# EAGLE design PCB1a_T-ETH-Lite-ESP32S3 (EAGLE 9.6.2)

## Sheet 1 of 3
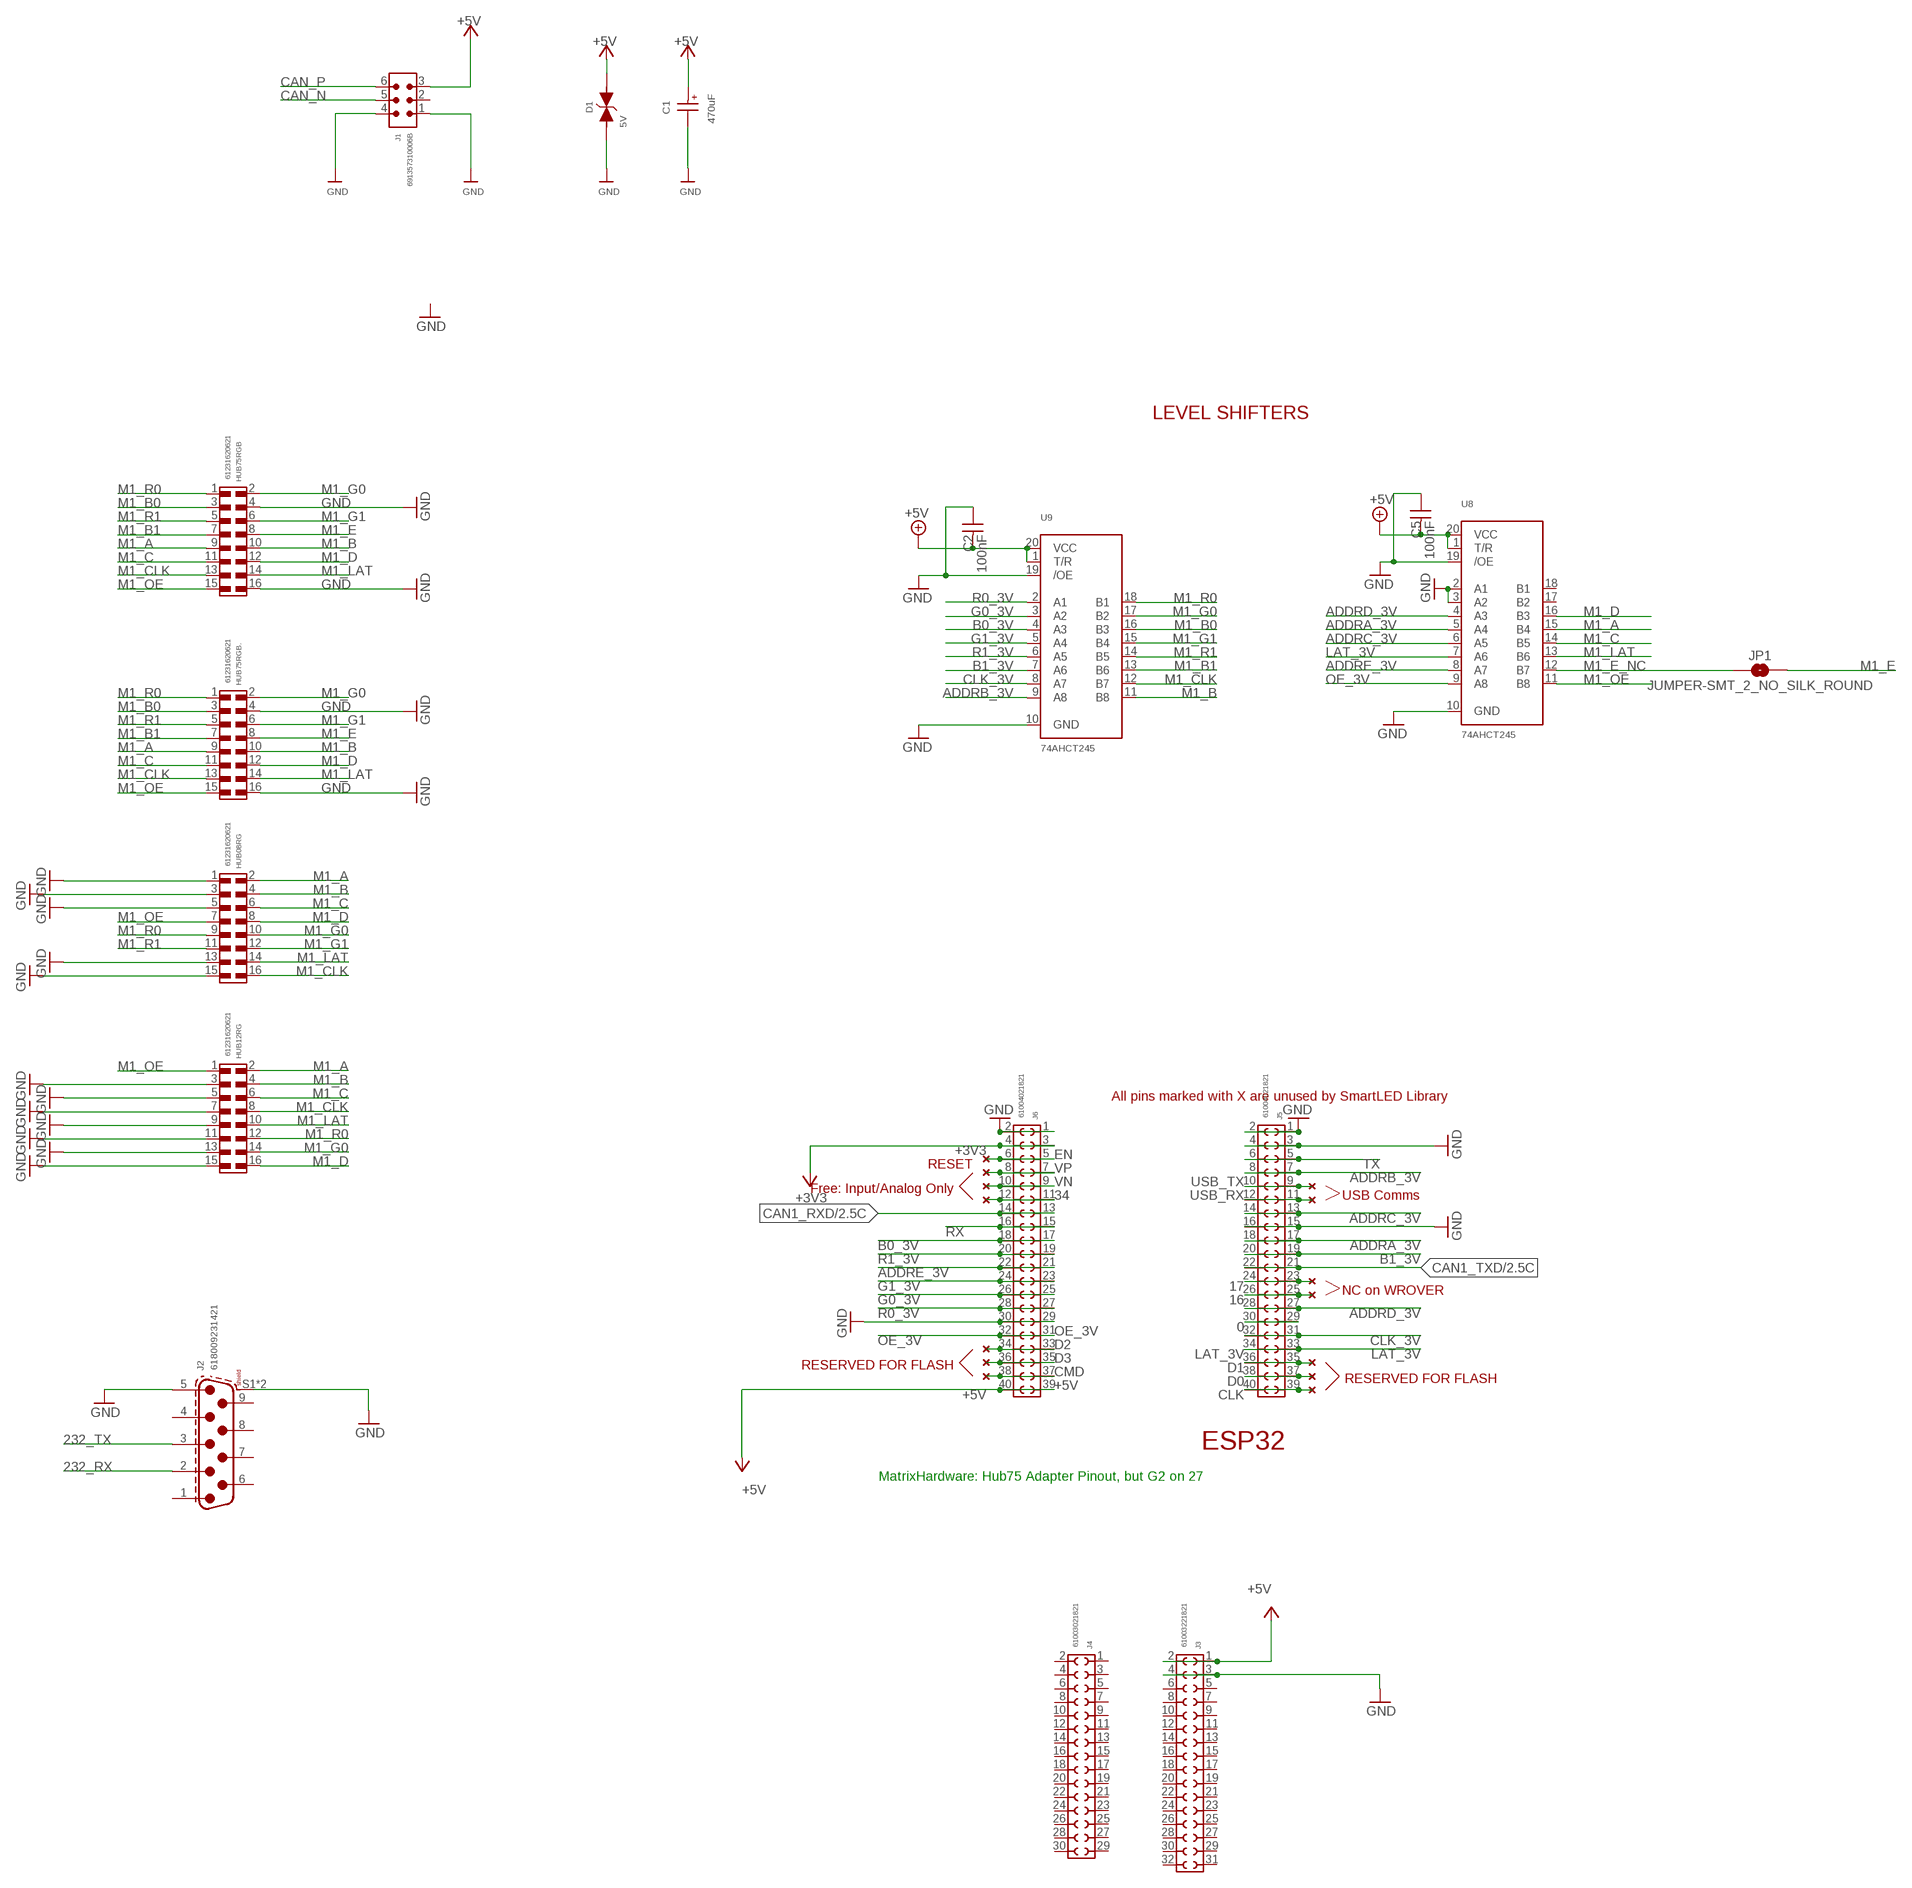
[diagram p0: schematic, sheet 1]

### Parts
C1  470uF  WCAP-AS5H_10X10.5_865230357008  [WCAP-AS5H_10X10.5(DXL)]
C2  100nF  WCAP-CSGP_0805_H0.8_885012207098_50V(DC)_R  [WCAP-CSGP_0805_H0.8_R]
C5  100nF  WCAP-CSGP_0805_H0.8_885012207098_50V(DC)_R  [WCAP-CSGP_0805_H0.8_R]
D1  5V  WE-TVSP_DO-214AB_3000W_BI_824551500  [WE-TVSP_DO-214AB_BIDIRECTIONAL]
HUB08RG  61231620621  6123XX20621_61231620621  [61231620621]
HUB12RG  61231620621  6123XX20621_61231620621  [61231620621]
HUB75RGB  61231620621  6123XX20621_61231620621  [61231620621]
HUB75RGB.  61231620621  6123XX20621_61231620621  [61231620621]
J1  691357310006B  [691357310006B]
J2  618009231421  6180XX231421_618009231421  [618009231421]
J3  61003221821  6100XX21821_61003221821  [61003221821]
J4  61003021821  6100XX21821_61003021821  [61003021821]
J5  61004021821  6100XX21821_61004021821  [61004021821]
J6  61004021821  6100XX21821_61004021821  [61004021821]
JP1  JUMPER-SMT_2_NO_SILK_ROUND  [SMT-JUMPER_2_NO_SILK_ROUND]
U8  74AHCT245  74LCX245_TSSOP20  [TSSOP20]
U9  74AHCT245  74LCX245_TSSOP20  [TSSOP20]
U$2  NC  (no package)
U$3  NC  (no package)
U$4  NC  (no package)
U$5  NC  (no package)
U$6  NC  (no package)
U$7  NC  (no package)
U$8  NC  (no package)
U$9  NC  (no package)
U$10  NC  (no package)
U$11  NC  (no package)
U$13  NC  (no package)
U$15  NC  (no package)
U$16  NC  (no package)
U$17  NC  (no package)

### Nets
0: J5.29 J5.30
16: J5.25 J5.26 U$17.P$1
17: J5.23 J5.24 U$16.P$1
34: J6.11 J6.12 U$10.P$1
232_RX: J2.2 ; also sheet 3
232_TX: J2.3 ; also sheet 3
+3V3: J6.3 J6.4 ; also sheet 2,3
+5V [usbvcc]: C1.1(+) C2.2 C5.2 D1.2 J1.3 J3.1 J3.2 J6.39 J6.40 U8.1(T/R) U8.20(VCC) U9.1(T/R) U9.20(VCC) ; also sheet 2
ADDRA_3V: J5.17 J5.18 U8.5(A4)
ADDRB_3V: J5.7 J5.8 U9.9(A8)
ADDRC_3V: J5.13 J5.14 U8.6(A5)
ADDRD_3V: J5.27 J5.28 U8.4(A3)
ADDRE_3V: J6.21 J6.22 U8.8(A7)
B0_3V: J6.17 J6.18 U9.4(A3)
B1_3V: J5.19 J5.20 U9.7(A6)
CAN1_RXD: J6.13 J6.14 ; also sheet 2
CAN1_TXD: J5.21 J5.22 ; also sheet 2
CAN_N: J1.5 ; also sheet 2
CAN_P: J1.6 ; also sheet 2
CLK: J5.39 J5.40 U$5.P$1
CLK_3V: J5.31 J5.32 U9.8(A7)
CMD: J6.37 J6.38 U$2.P$1
D0: J5.37 J5.38 U$6.P$1
D1: J5.35 J5.36 U$7.P$1
D2: J6.33 J6.34 U$4.P$1
D3: J6.35 J6.36 U$3.P$1
EN: J6.5 J6.6 U$11.P$1
G0_3V: J6.25 J6.26 U9.3(A2)
G1_3V: J6.23 J6.24 U9.5(A4)
GND: C1.2(-) C2.1 C5.1 D1.1 HUB08RG.1 HUB08RG.3 HUB08RG.5 HUB08RG.13 HUB08RG.15 HUB12RG.3 HUB12RG.5 HUB12RG.7 HUB12RG.9 HUB12RG.11 HUB12RG.13 HUB12RG.15 HUB75RGB.4 HUB75RGB.16 HUB75RGB..4 HUB75RGB..16 J1.1 J1.4 J2.5 J2.S1(SHIELD) J2.S2(SHIELD) J3.3 J3.4 J5.1 J5.2 J5.3 J5.4 J5.15 J5.16 J6.1 J6.2 J6.29 J6.30 U8.2(A1) U8.3(A2) U8.10(GND) U8.19(/OE) U9.10(GND) U9.19(/OE) ; also sheet 2,3
LAT_3V: J5.33 J5.34 U8.7(A6)
M1_A: HUB08RG.2 HUB12RG.2 HUB75RGB.9 HUB75RGB..9 U8.15(B4)
M1_B: HUB08RG.4 HUB12RG.4 HUB75RGB.10 HUB75RGB..10 U9.11(B8)
M1_B0: HUB75RGB.3 HUB75RGB..3 U9.16(B3)
M1_B1: HUB75RGB.7 HUB75RGB..7 U9.13(B6)
M1_C: HUB08RG.6 HUB12RG.6 HUB75RGB.11 HUB75RGB..11 U8.14(B5)
M1_CLK: HUB08RG.16 HUB12RG.8 HUB75RGB.13 HUB75RGB..13 U9.12(B7)
M1_D: HUB08RG.8 HUB12RG.16 HUB75RGB.12 HUB75RGB..12 U8.16(B3)
M1_E: HUB75RGB.8 HUB75RGB..8 JP1.2
M1_E_NC: JP1.1 U8.12(B7)
M1_G0: HUB08RG.10 HUB12RG.14 HUB75RGB.2 HUB75RGB..2 U9.17(B2)
M1_G1: HUB08RG.12 HUB75RGB.6 HUB75RGB..6 U9.15(B4)
M1_LAT: HUB08RG.14 HUB12RG.10 HUB75RGB.14 HUB75RGB..14 U8.13(B6)
M1_OE: HUB08RG.7 HUB12RG.1 HUB75RGB.15 HUB75RGB..15 U8.11(B8)
M1_R0: HUB08RG.9 HUB12RG.12 HUB75RGB.1 HUB75RGB..1 U9.18(B1)
M1_R1: HUB08RG.11 HUB75RGB.5 HUB75RGB..5 U9.14(B5)
OE_3V: J6.31 J6.32 U8.9(A8)
R0_3V: J6.27 J6.28 U9.2(A1)
R1_3V: J6.19 J6.20 U9.6(A5)
RX: J6.15 J6.16 ; also sheet 3
TX: J5.5 J5.6 ; also sheet 3
USB_RX: J5.11 J5.12 U$15.P$1
USB_TX: J5.9 J5.10 U$13.P$1
VN: J6.9 J6.10 U$8.P$1
VP: J6.7 J6.8 U$9.P$1
Unconnected: J1.2 J2.1 J2.4 J2.6 J2.7 J2.8 J2.9 J3.5 J3.6 J3.7 J3.8 J3.9 J3.10 J3.11 J3.12 J3.13 J3.14 J3.15 J3.16 J3.17 J3.18 J3.19 J3.20 J3.21 J3.22 J3.23 J3.24 J3.25 J3.26 J3.27 J3.28 J3.29 J3.30 J3.31 J3.32 J4.1 J4.2 J4.3 J4.4 J4.5 J4.6 J4.7 J4.8 J4.9 J4.10 J4.11 J4.12 J4.13 J4.14 J4.15 J4.16 J4.17 J4.18 J4.19 J4.20 J4.21 J4.22 J4.23 J4.24 J4.25 J4.26 J4.27 J4.28 J4.29 J4.30 U8.17(B2) U8.18(B1)

### Notes on the sheet
- LEVEL SHIFTERS
- All pins marked with X are unused by SmartLED Library
- RESET
- Free: Input/Analog Only
- USB Comms
- NC on WROVER
- RESERVED FOR FLASH
- RESERVED FOR FLASH
- ESP32
- MatrixHardware: Hub75 Adapter Pinout, but G2 on 27

## Sheet 2 of 3
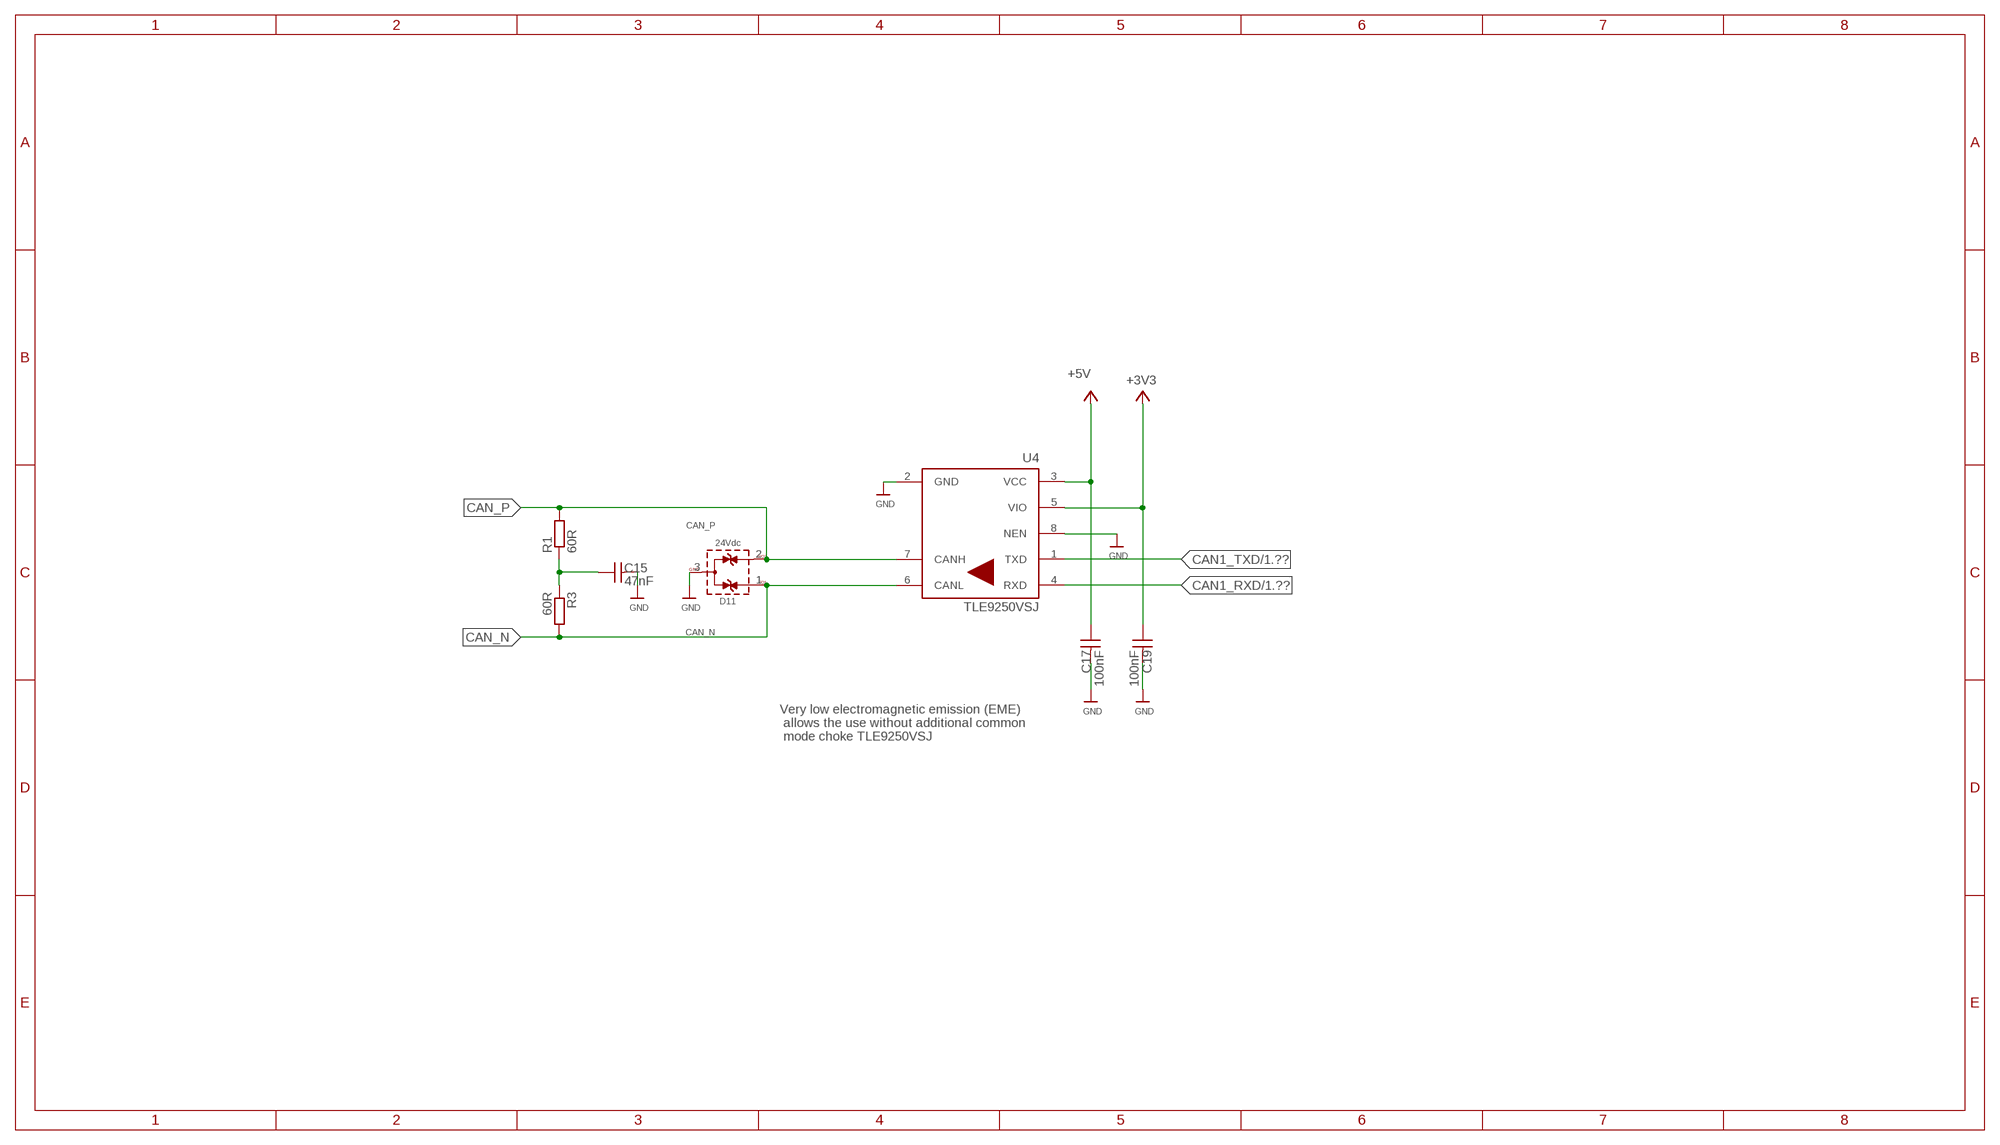
[diagram p1: schematic, sheet 2]

### Parts
C15  47nF  WCAP-CSGP_0805_H0.8_885012207096_50V(DC)_R  [WCAP-CSGP_0805_H0.8_R]
C17  100nF  WCAP-CSGP_0805_H0.8_885012207098_50V(DC)_R  [WCAP-CSGP_0805_H0.8_R]
C19  100nF  WCAP-CSGP_0805_H0.8_885012207098_50V(DC)_R  [WCAP-CSGP_0805_H0.8_R]
D11  24Vdc  WE-TVS_SOT23-3L_824094024  [WE-TVS_SOT23-3L]
R1  60R  R-EU_R0805  [R0805]
R3  60R  R-EU_R0805  [R0805]
U4  TLE9250VSJ  [SOIC127P602X173-8N-V]

### Nets
+3V3: C19.1 U4.5(VIO) ; also sheet 1,3
+5V [usbvcc]: C17.1 U4.3(VCC) ; also sheet 1
CAN1_RXD: U4.4(RXD) ; also sheet 1
CAN1_TXD: U4.1(TXD) ; also sheet 1
CAN_N: D11.1(I/O1) R3.2 U4.6(CANL) ; also sheet 1
CAN_P: D11.2(I/O2) R1.2 U4.7(CANH) ; also sheet 1
GND: C15.2 C17.2 C19.2 D11.3(GND) U4.2(GND) U4.8(NEN) ; also sheet 1,3
N$20: C15.1 R1.1 R3.1

### Notes on the sheet
- Very low electromagnetic emission (EME)
   allows the use without additional common
   mode choke TLE9250VSJ

## Sheet 3 of 3
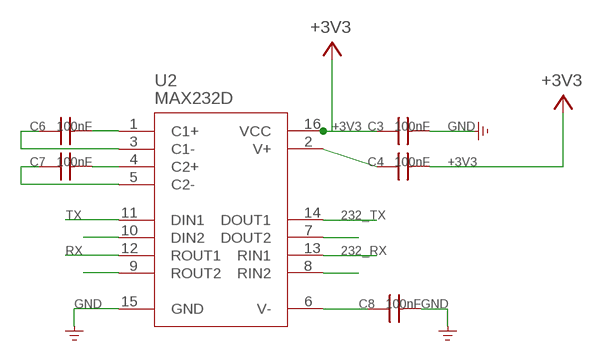
[diagram p2: schematic, sheet 3]

### Parts
C3  100nF  WCAP-CSGP_0805_H0.8_885012207098_50V(DC)_R  [WCAP-CSGP_0805_H0.8_R]
C4  100nF  WCAP-CSGP_0805_H0.8_885012207098_50V(DC)_R  [WCAP-CSGP_0805_H0.8_R]
C6  100nF  WCAP-CSGP_0805_H0.8_885012207098_50V(DC)_R  [WCAP-CSGP_0805_H0.8_R]
C7  100nF  WCAP-CSGP_0805_H0.8_885012207098_50V(DC)_R  [WCAP-CSGP_0805_H0.8_R]
C8  100nF  WCAP-CSGP_0805_H0.8_885012207098_50V(DC)_R  [WCAP-CSGP_0805_H0.8_R]
U2  MAX232D  MAX3232-SOIC16  [SOIC16]

### Nets
232_RX: U2.13(RIN1) ; also sheet 1
232_TX: U2.14(DOUT1) ; also sheet 1
+3V3: C3.1 C4.2 U2.16(VCC) ; also sheet 1,2
GND: C3.2 C8.2 U2.15(GND) ; also sheet 1,2
N$33: C6.2 U2.1(C1+)
N$34: C6.1 U2.3(C1-)
N$35: C7.2 U2.4(C2+)
N$36: C7.1 U2.5(C2-)
N$37: C4.1 U2.2(V+)
N$38: C8.1 U2.6(V-)
N$39: U2.9(ROUT2)
N$40: U2.10(DIN2)
N$46: U2.7(DOUT2)
N$47: U2.8(RIN2)
RX: U2.12(ROUT1) ; also sheet 1
TX: U2.11(DIN1) ; also sheet 1

## Library data of the parts
C1 = Wurth_Capacitors_WCAP-AS5H:WCAP-AS5H_10X10.5: WCAP-AS5H Aluminium Electrolytic Capacitors Long Life +105 °C Characteristics Long life product series Mounting style: V-Chip SMT Capacitance range: 0.1 µF ‒ 1000 µF Capacitance tolerance: ±20 % Voltage range (UR): 6.3 ‒ 50 V(DC) Operating temperature: -40 °C up to +105 °C Endurance: 5000 h @ +105 °C Dimensions (DxL) in mm: 4.0 x 5.5 up to 10.0 x 10.5 Recommended soldering: Reflow soldering Applications Long life applications (industry, medical) Input and output capacitor for switched-mode power supply Filtering Smoothing e.g. DC/DC converter, AC/DC converter, satellite receiver, control panel <https://www.we-online.com/catalog/media/o55801v209%20Family_WCAP-AS5H.jpg> Details see: www.we-online.com/catalog/WCAP-AS5H <www.we-online.com/catalog/WCAP-AS5H/?utm_source=eagle_model&utm_medium=description_link&utm_campaign=eisos_eagle> Updated by Ella Wu 2022-07-27 2022(C) Würth Elektronik; DATASHEET-URL: https://www.we-online.com/redexpert/spec/865230357008?ae; DF: 22%; DIAMETER: 10mm; ENDURANCE: 5000h; HEIGHT: 10.5mm; I-LEAK: 75.2uA; I-RIPPLE: 320mA; OPERATING-TEMPERATURE: -40 °C up to +105 °C; PART-NUMBER: 865230357008; TECHNICAL-REFERENCE: ASDF105471M016DVCTEE000; VR: 16V(DC)
C2-C8 C17 C19 = Wurth_Capacitors_WCAP-CSGP:WCAP-CSGP_0805_H0.8: WCAP-CSGP MLCCs 0805 Characteristics General purpose product series High performance ceramic High electrical precision and stability ceramic especially for NP0 Minimal aging especially for NP0 Mounting style: SMT-Chip Ceramic: NP0 (Class I), X5R (Class II), X7R (Class II) Temperature coefficient: ±30 ppm/°C; ±0.54 % for NP0 ±15 % for X5R and X7R Operating temperature: -55 °C up to + 125 °C for NP0 and X7R -55 °C up to + 85 °C for X5R Termination: Cu/Ni/Sn Recommended soldering: Reflow soldering Wave soldering for size 0603 Wave soldering for size 0805 (only valid for the thickness ≤0.85 mm) Applications Temperature compensation (NP0) Coupling Decoupling Bypass Smoothing Filtering Resonant circuit <https://www.we-online.com/catalog/media/o177837v209%20MLCC_GRP_all.jpg> Details see: https://www.we-online.com/catalog/en/pbs/capacitors/multilayer_ceramic_chip_capacitors/mlcc_general_purpose Updated by Ella Wu 2022-02-15 2022(C) Würth Elektronik; CERAMIC-TYPE: X7R Class II; DATASHEET-URL: https://www.we-online.com/redexpert/spec/885012207098?ae; DF: 2.5%; HEIGHT: 0.8mm; MOUNT: SMT; OPERATING-TEMPERATURE: -55 up to +125 °C; PART-NUMBER: 885012207098; QMIN: -; RISO: 5GOhm; SIZE: 0805; TECHNICAL-REFERENCE: X7R0805104K050DFCT10000; VR: 50V(DC)
C15 = Wurth_Capacitors_WCAP-CSGP:WCAP-CSGP_0805_H0.8: WCAP-CSGP MLCCs 0805 Characteristics General purpose product series High performance ceramic High electrical precision and stability ceramic especially for NP0 Minimal aging especially for NP0 Mounting style: SMT-Chip Ceramic: NP0 (Class I), X5R (Class II), X7R (Class II) Temperature coefficient: ±30 ppm/°C; ±0.54 % for NP0 ±15 % for X5R and X7R Operating temperature: -55 °C up to + 125 °C for NP0 and X7R -55 °C up to + 85 °C for X5R Termination: Cu/Ni/Sn Recommended soldering: Reflow soldering Wave soldering for size 0603 Wave soldering for size 0805 (only valid for the thickness ≤0.85 mm) Applications Temperature compensation (NP0) Coupling Decoupling Bypass Smoothing Filtering Resonant circuit <https://www.we-online.com/catalog/media/o177837v209%20MLCC_GRP_all.jpg> Details see: https://www.we-online.com/catalog/en/pbs/capacitors/multilayer_ceramic_chip_capacitors/mlcc_general_purpose Updated by Ella Wu 2022-02-15 2022(C) Würth Elektronik; CERAMIC-TYPE: X7R Class II; DATASHEET-URL: https://www.we-online.com/redexpert/spec/885012207096?ae; DF: 2.5%; HEIGHT: 0.8mm; MOUNT: SMT; OPERATING-TEMPERATURE: -55 up to +125 °C; PART-NUMBER: 885012207096; QMIN: -; RISO: 10GOhm; SIZE: 0805; TECHNICAL-REFERENCE: X7R0805473K050DFCT10000; VR: 50V(DC)
D1 = Wurth_EMC Components_WE-TVSP:WE-TVSP_DO-214AB_3000W_BI: WE-TVSP Power TVS Diode Characteristics Low Profile Package Glass passivated Juction Excellent clamping capability Fast response time MSL Level 1, per J-STD-020 Classification of the plastic case: UL 94 V-0 Safety certification UL 497B, E478010 Identical design: - DO-214AC = SMAJ - DO-214AA = SMBJ - DO-214AB = SMCJ/SMDJ Applications Ideal to protect the I/O Interfaces, Bus Voltage and other circuits of sensetive electronic equipment against voltage transiensts <https://www.we-online.com/catalog/media/o55793v209%20WE-TVSP_600W-3000W_D0214AA_4C.jpg> Details see: https://www.we-online.com/catalog/en/WE-TVSP/ Updated by Ella Wu 2020-07-20 2020 (C) Würth Elektronik; DATASHEET-URL: https://www.we-online.com/catalog/datasheet/824551500.pdf; IPEAK: 326.1A; MOUNT: SMT; PART-NUMBER: 824551500; PDISS: 3000W; VBR: 6.7V; VCLAMP: 9.2V
D11 = Wurth_EMC Components_WE-TVS:WE-TVS_SOT23-3L_824094024: WE-TVS TVS Diode – Standard Series Characteristics Fast turn-on Low clamping voltage High ESD withstand voltage Uni- or bidirectional protection Small package Epoxy flame resistant UL94 V-0 Applications DC power supply USB Power Delivery (PD) Headsets and accessories PDAs Digital cameras MP3-Player Touch Panels Notebooks ESD, EFT and Surge Protection ESD protection in accordance with EN 61000-4-2 – 8 kV contact discharge – 15 kV air discharge <https://www.we-online.com/catalog/media/o106433v209%20Family_WE-TVS_Standard.jpg> Details see: https://www.we-online.com/catalog/en/WE-TVS Created by Ella Wu 2021-12-15 2021 (C) Wurth Elektronik; C-CH: 38pF; CHANNELS: 2; DATASHEET-URL: https://www.we-online.com/catalog/datasheet/824094024.pdf; IPEAK: 6A; MOUNT: SMT; PART-NUMBER: 824094024; VBR: 26.2V
HUB08RG HUB12RG HUB75RGB HUB75RGB. = Wurth_Connectors_WR-BHD:6123XX20621_61231620621: WR-BHD 2.54 mm Male SMT Box Header Material Properties: Insulator Material PA 9T; PA9T Insulator Flammability Rating UL94 V-0 Color Black Contact Material Copper Alloy Contact Plating Gold Contact Type Stamped General Information Operating Temperature -40 up to +125 °C Compliance RoHS Working Voltage 250 V (AC) Withstanding Voltage 500 V (AC) Contact Resistance 20 mΩ RISO 1000 MΩ Pitch 2.54 mm Gender Male Certification UL Approval E323964 Packaging Properties Packaging Tape and Reel with Cap <https://www.we-online.com/components/media/o32919v209%20Family_WR-BHD_612xxx20621.jpg> Details see: www.we-online.com/en/components/products/BHD_2_54_SMT_MALE_BOX_HEADER_6120XX20621 <www.we-online.com/catalog/BHD_2_54_SMT_MALE_BOX_HEADER_6120XX20621/?utm_source=eagle_model&utm_medium=description_link&utm_campaign=eisos_eagle> Updated by Ella Wu 2022-09-06 2022 (C) Würth Elektronik; CONTACT-RESISTANCE: 20mOhm; DATASHEET-URL: https://www.we-online.com/redexpert/spec/61231620621?ae; GENDER: Male; IR: 3A; LENGTH: 27.94mm; MOUNT: SMT; PACKAGING: Tape and Reel with Cap; PART-NUMBER: 61231620621; PINS: 16; PITCH: 2.54mm; TYPE: Straight; WORKING-VOLTAGE: 250V(AC)
J1 = Wurth_Connectors_WR-TBL Pluggable Connector:691357310006B: WR-TBL Serie 357B - 3.81 mm Double Level Horizontal Male PCB Header with Flanges KIND PROPERTIES Pitch 3.81 mm MATERIAL PROPERTIES Insulator Material PA66 Insulator Flammability Rating UL94 V-0 Contact Material Brass Contact Plating Tin GENERAL INFORMATION Operating Temperature -40 up to +105 °C Compliance RoHS ELECTRICAL PROPERTIES IR UL 10 A Working Voltage [UL] 300 V (AC) Withstanding Voltage [cULus] 2000 V (AC) Contact Resistance [cULus] 20 mΩ CERTIFICATION cULus Approval E315414 <https://www.we-online.com/catalog/media/o60711v209%20Family_WR-TBL_Serie_357B_6913573100xxB.jpg> Details see: https://www.we-online.com/catalog/en/TBL_3_81_357B_DOUBLE_LEVEL_HORIZONTAL_MALE_PCB_HEADER_W_FLANGES_6913573100XXB/ Updated by Ella Wu 2019-12-23 2022(C) Wurth Elektronik; DATASHEET-URL: https://www.we-online.com/redexpert/spec/691357310006B?ae; IR-UL: 10A; MOUNT: THT; PART-NUMBER: 691357310006B; PINS: 6; PITCH: 3.81mm; TYPE: Double Level Horizontal; WORKING-VOLTAGE-UL: 300V (AC)
J2 = Wurth_Connectors_WR-DSUB:6180XX231421_618009231421: WR-DSUB 10.30 mm Male Angled PCB Connector w. Hex Screw Kind Properties Quality Class:3 as per CECC 75 301-802 Gender:Male Type:Angled Insulator Material:PBT Insulator Flammability Rating:UL94 V-0 Color:Black Contact Material:Copper Alloy Contact Plating:Selective Gold Contact Type:Stamped Shielding Material:Steel Shielding Plating:Nickel General Information Operating Temperature:-55 up to +105 °C Compliance:RoHS Electrical Properties IR1:3 A Working Voltage:125 V (AC) Withstanding Voltage:1000 V (AC) Contact Resistance:30 mΩ <https://www.we-online.com/catalog/media/o60849v209%20Family_I-O_DSUB_PCB_Male_w-screw_6180xx231421_pf2.jpg> Details see: https://www.we-online.com/en/components/products/DSUB_MALE_ANGLED_PCB_CONNECTOR_W_HEX_SCREW_10_30MM_6180XX231421 Updated by Ella Wu 2023-03-21 2023 (C) Würth Elektronik; DATASHEET-URL: https://www.we-online.com/redexpert/spec/618009231421?ae; GENDER: Male; PART-NUMBER: 618009231421; PINS: 9; TYPE: Angled; WE-NUMBER: 618009231421; WORKING-VOLTAGE: 125 V(AC)
J3 = Wurth_Connectors_WR-PHD:6100XX21821_61003221821: WR-PHD 2.54mm SMT Socket Header ARTICLE PROPERTIES Pins: 4;​ 6;​ 8;​ 10;​ 12;​ 14;​ 16;​ 18;​ 20;​ 22;​ 24;​ 26;​ 28;​ 30;​ 32;​ 34;​ 36;​ 40 KIND PROPERTIES Pitch 2.54 mm Quality Class 3 as per CECC 75 301-802 Rows Dual Gender Socket Header Type Straight MATERIAL PROPERTIES Insulator Material PA9T Insulator Flammability Rating UL94 V-0 Contact Material Copper Alloy Contact Plating Gold Contact Type Stamped GENERAL INFORMATION Operating Temperature -40 up to +105 °C Compliance Lead free / RoHS ELECTRICAL PROPERTIES Rated Current 3 A;​ max. IR 1 3 A Withstanding Voltage 600 V (AC) Contact Resistance 20 mΩ RISO 1000 MΩ PACKAGING PROPERTIES Packaging Tube <https://katalog.we-online.com/media/images/v2/o33206v209%20Family_WR-PHD_610xxx21821.jpg> Details see: http://katalog.we-online.de/en/em/PHD_2_54_SMT_DUAL_SOCKET_HEADER_6100XX21821 Updated by Ella Wu 2019-06-12 2019 (C) Würth Elektronik; DATASHEET-URL: https://www.we-online.com/redexpert/spec/61003221821?ae; GENDER: Socket Header; IR: 3A; MOUNT: SMT; PACKAGING: Tube; PART-NUMBER: 61003221821; PINS: 32; PITCH: 2.54mm; ROWS: Dual; TYPE: Straight; WE-NUMBER: 61003221821
J4 = Wurth_Connectors_WR-PHD:6100XX21821_61003021821: WR-PHD 2.54mm SMT Socket Header ARTICLE PROPERTIES Pins: 4;​ 6;​ 8;​ 10;​ 12;​ 14;​ 16;​ 18;​ 20;​ 22;​ 24;​ 26;​ 28;​ 30;​ 32;​ 34;​ 36;​ 40 KIND PROPERTIES Pitch 2.54 mm Quality Class 3 as per CECC 75 301-802 Rows Dual Gender Socket Header Type Straight MATERIAL PROPERTIES Insulator Material PA9T Insulator Flammability Rating UL94 V-0 Contact Material Copper Alloy Contact Plating Gold Contact Type Stamped GENERAL INFORMATION Operating Temperature -40 up to +105 °C Compliance Lead free / RoHS ELECTRICAL PROPERTIES Rated Current 3 A;​ max. IR 1 3 A Withstanding Voltage 600 V (AC) Contact Resistance 20 mΩ RISO 1000 MΩ PACKAGING PROPERTIES Packaging Tube <https://katalog.we-online.com/media/images/v2/o33206v209%20Family_WR-PHD_610xxx21821.jpg> Details see: http://katalog.we-online.de/en/em/PHD_2_54_SMT_DUAL_SOCKET_HEADER_6100XX21821 Updated by Ella Wu 2019-06-12 2019 (C) Würth Elektronik; DATASHEET-URL: https://www.we-online.com/redexpert/spec/61003021821?ae; GENDER: Socket Header; IR: 3A; MOUNT: SMT; PACKAGING: Tube; PART-NUMBER: 61003021821; PINS: 30; PITCH: 2.54mm; ROWS: Dual; TYPE: Straight; WE-NUMBER: 61003021821
J5 J6 = Wurth_Connectors_WR-PHD:6100XX21821_61004021821: WR-PHD 2.54mm SMT Socket Header ARTICLE PROPERTIES Pins: 4;​ 6;​ 8;​ 10;​ 12;​ 14;​ 16;​ 18;​ 20;​ 22;​ 24;​ 26;​ 28;​ 30;​ 32;​ 34;​ 36;​ 40 KIND PROPERTIES Pitch 2.54 mm Quality Class 3 as per CECC 75 301-802 Rows Dual Gender Socket Header Type Straight MATERIAL PROPERTIES Insulator Material PA9T Insulator Flammability Rating UL94 V-0 Contact Material Copper Alloy Contact Plating Gold Contact Type Stamped GENERAL INFORMATION Operating Temperature -40 up to +105 °C Compliance Lead free / RoHS ELECTRICAL PROPERTIES Rated Current 3 A;​ max. IR 1 3 A Withstanding Voltage 600 V (AC) Contact Resistance 20 mΩ RISO 1000 MΩ PACKAGING PROPERTIES Packaging Tube <https://katalog.we-online.com/media/images/v2/o33206v209%20Family_WR-PHD_610xxx21821.jpg> Details see: http://katalog.we-online.de/en/em/PHD_2_54_SMT_DUAL_SOCKET_HEADER_6100XX21821 Updated by Ella Wu 2019-06-12 2019 (C) Würth Elektronik; DATASHEET-URL: https://www.we-online.com/redexpert/spec/61004021821?ae; GENDER: Socket Header; IR: 3A; MOUNT: SMT; PACKAGING: Tube; PART-NUMBER: 61004021821; PINS: 40; PITCH: 2.54mm; ROWS: Dual; TYPE: Straight; WE-NUMBER: 61004021821
JP1 = SparkFun-Jumpers:JUMPER-SMT_2_NO: Normally open jumper This jumper has two pads in close proximity to each other. Apply solder to close the connection. Round pads are easier to solder for beginners, but are a lot larger. SparkFun Product that uses the round pads: SparkFun EL Sequencer <https://www.sparkfun.com/products/12781>
R1 R3 = resistor:R-EU_: RESISTOR, European symbol
U2 = IC:MAX3232
U4 = TLE9250VSJ:TLE9250VSJ: TLE9250VSJ SOIC127P602X173-8N-V High Speed CAN FD Transceiver; ARTIKEL_NR: 545599
U8 U9 = microbuilder:74LCX245: 74LCX245MTC - 5.0V Tolerant Bi-Directional Buffer Can be used to interface 5.0V logic to 2.5 or 3.3V devices Digikey: 74LCX245MTCXTR-ND Mouser: 512-74LCX245MTCX
U$2-U$11 U$13 U$15-U$17 = eclibrary:NC

## Net classes
1 power: width 0.305 mm
2 lowpower: width 0.305 mm, drill 0.483 mm

## Board
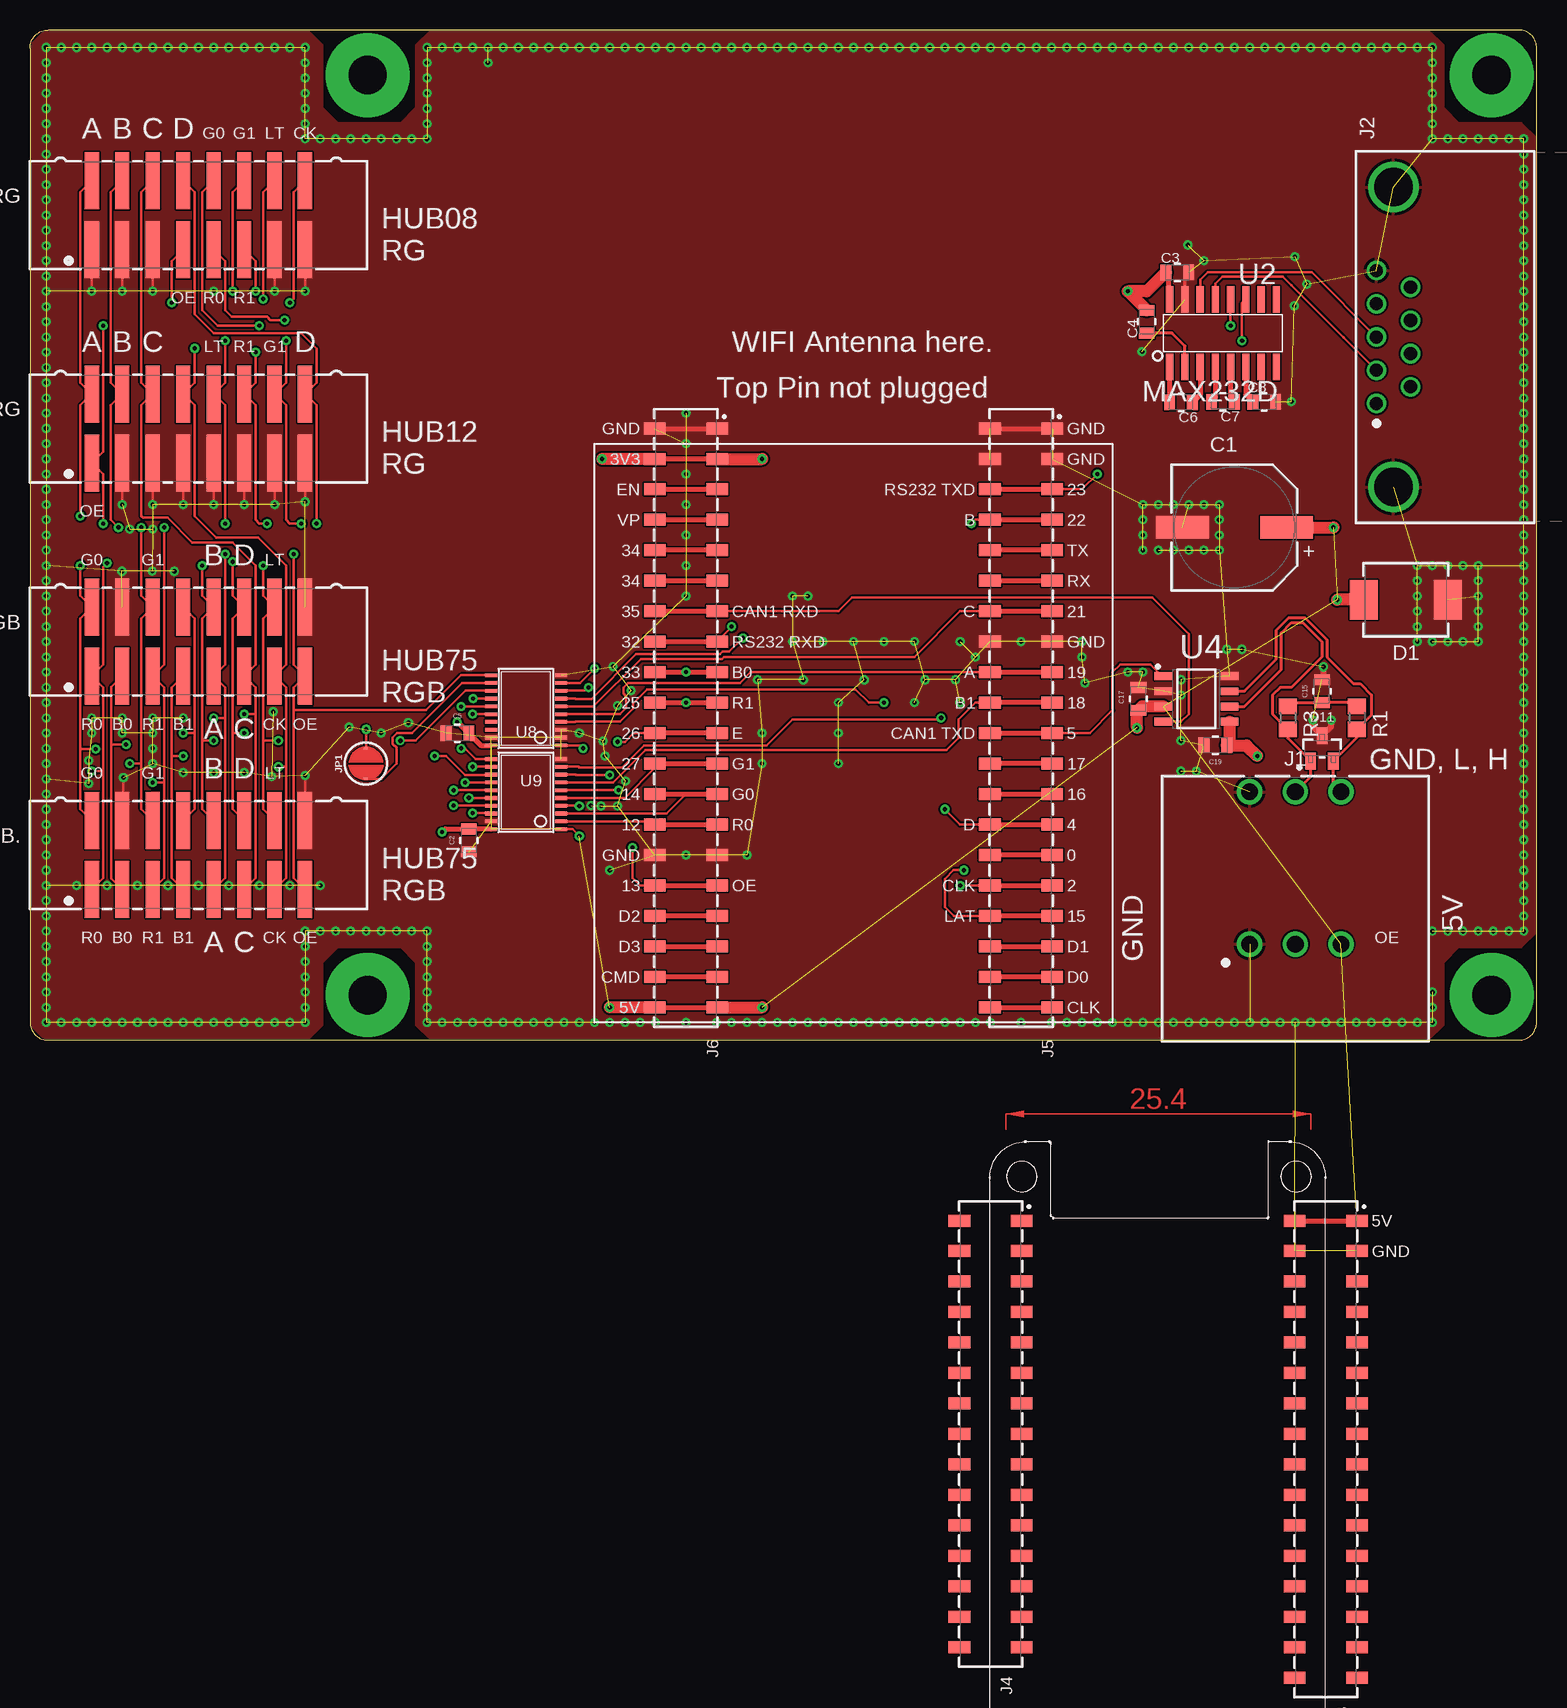
[diagram p3: board, top side]
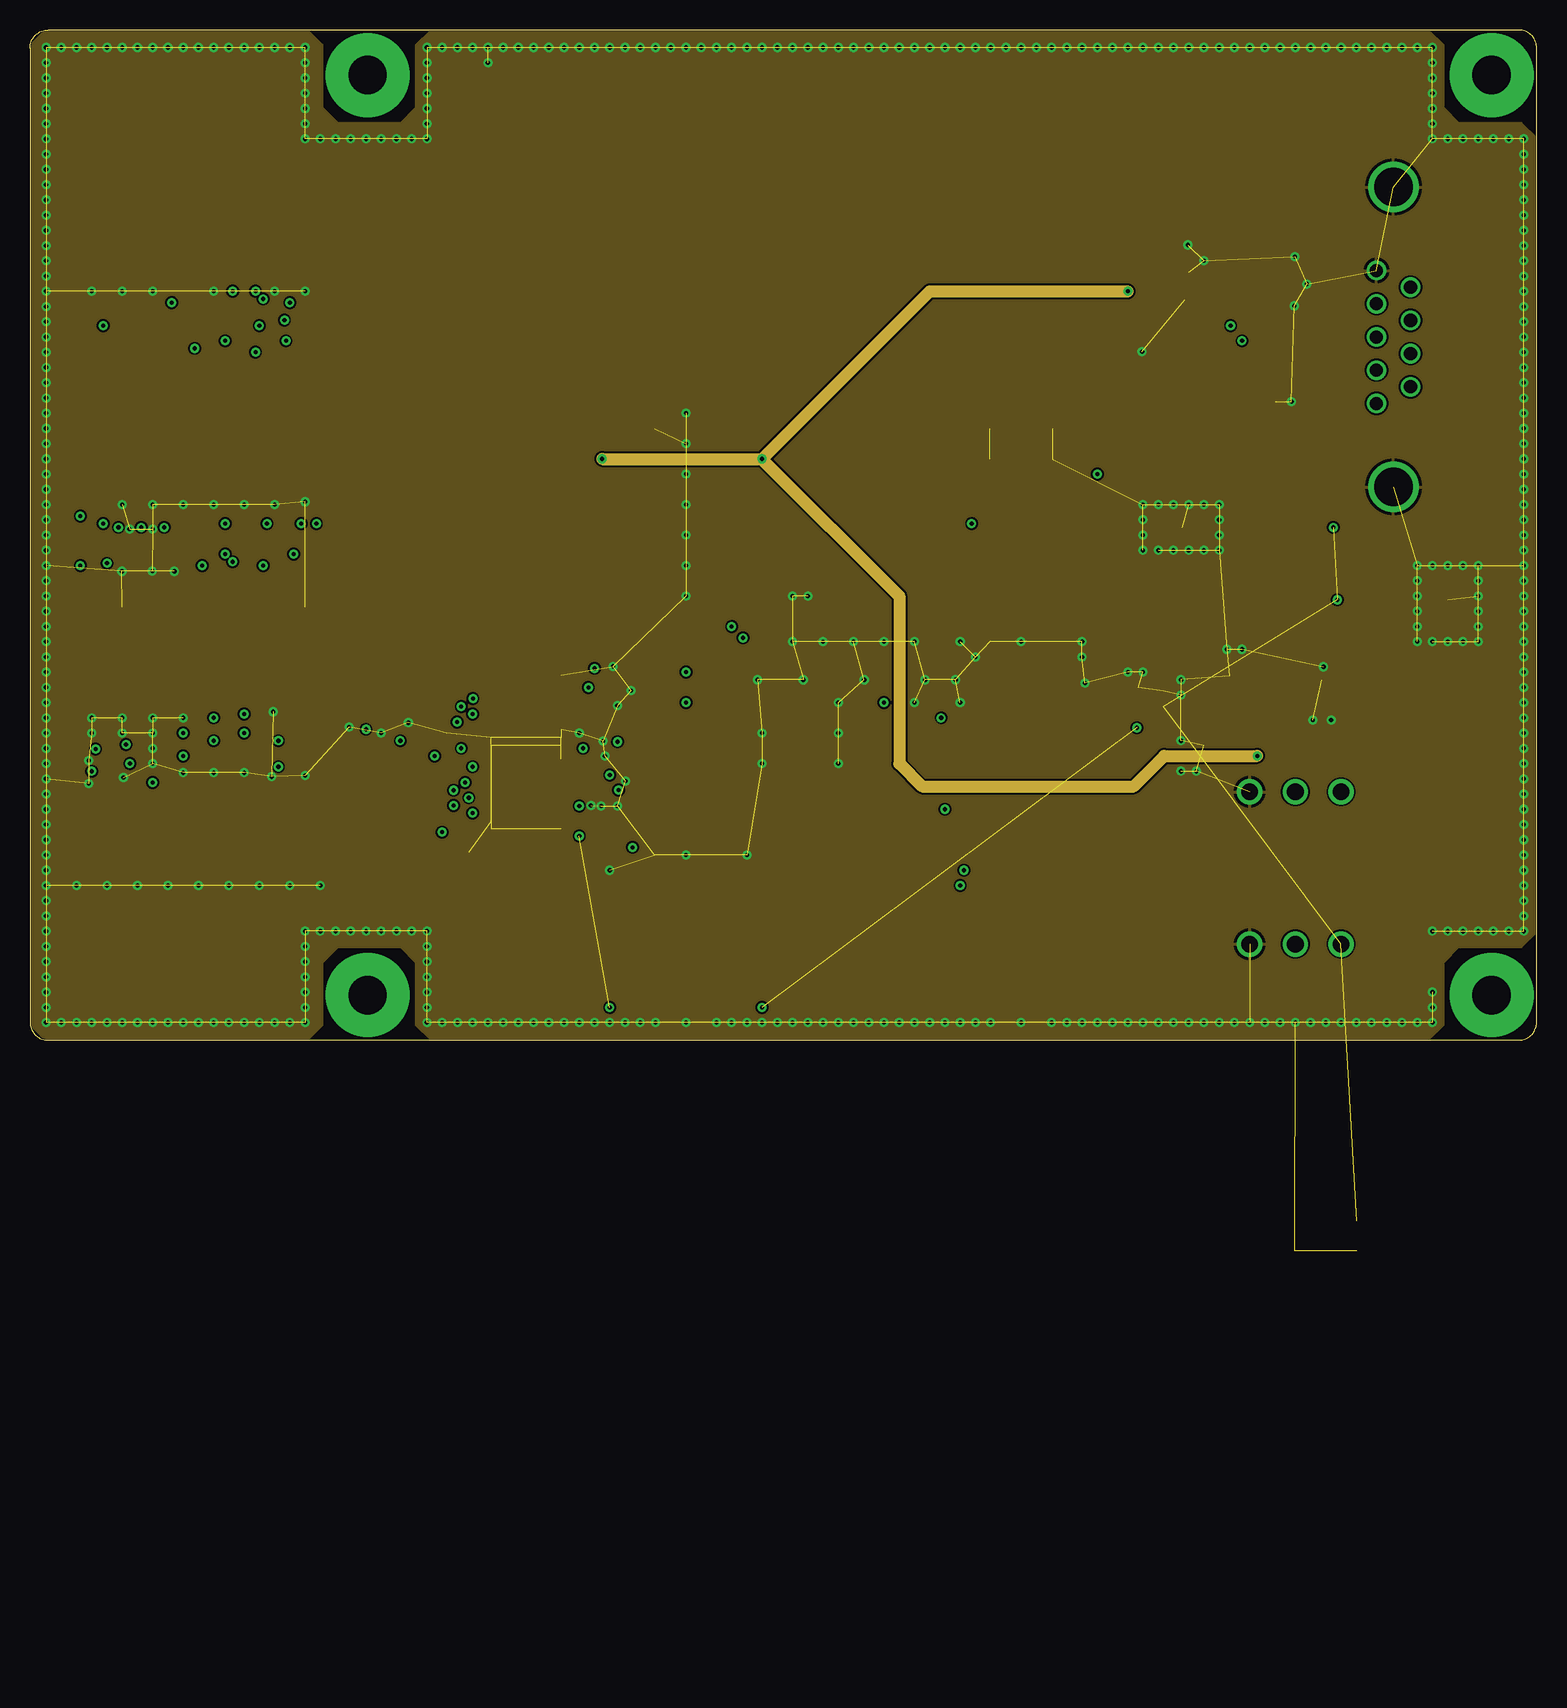
[diagram p4: board, inner layer Route2]
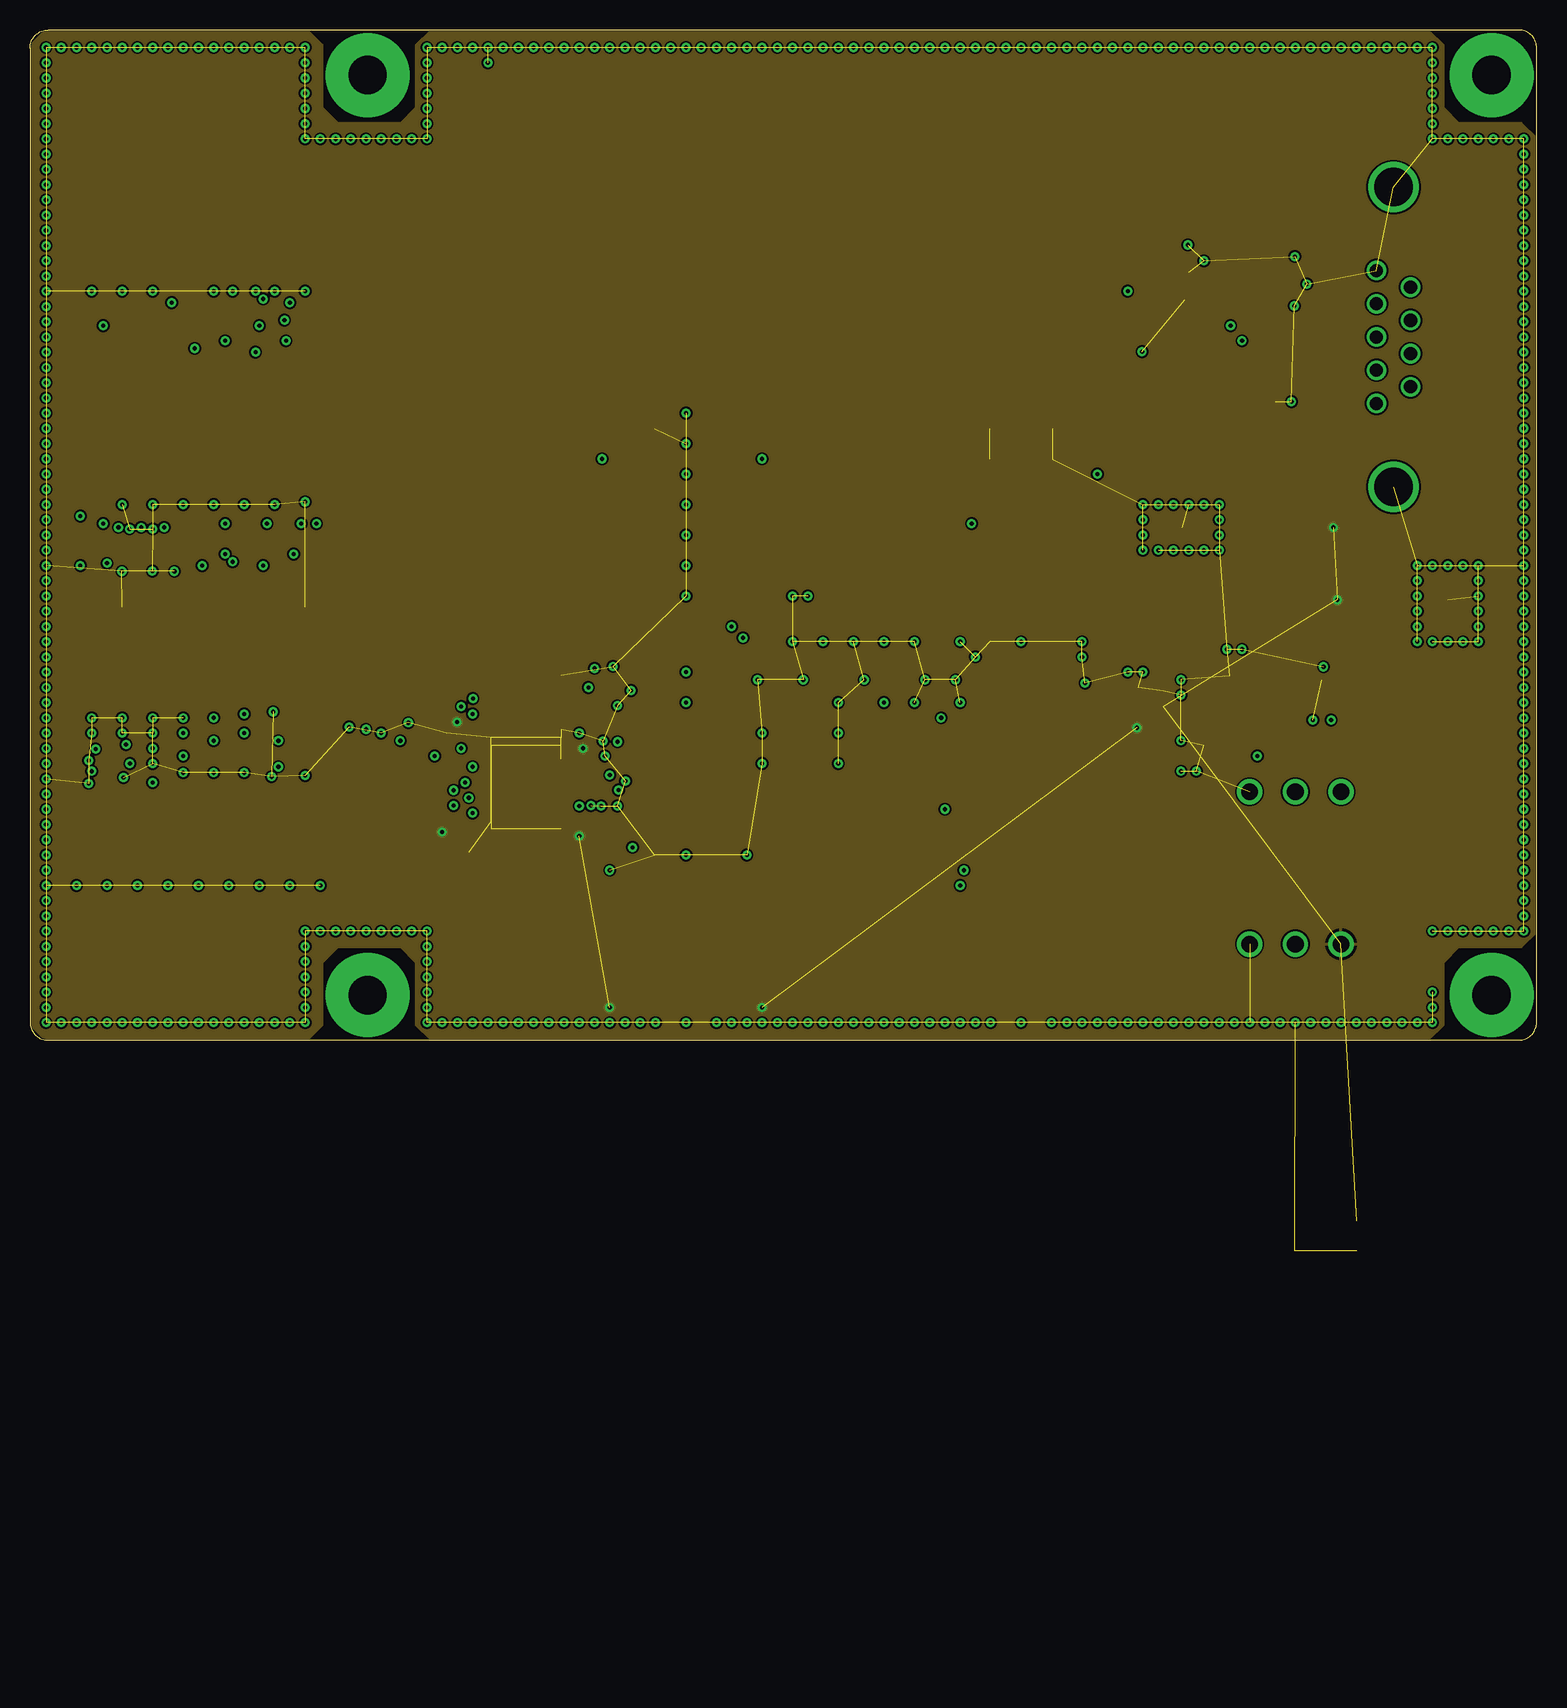
[diagram p5: board, inner layer Route15]
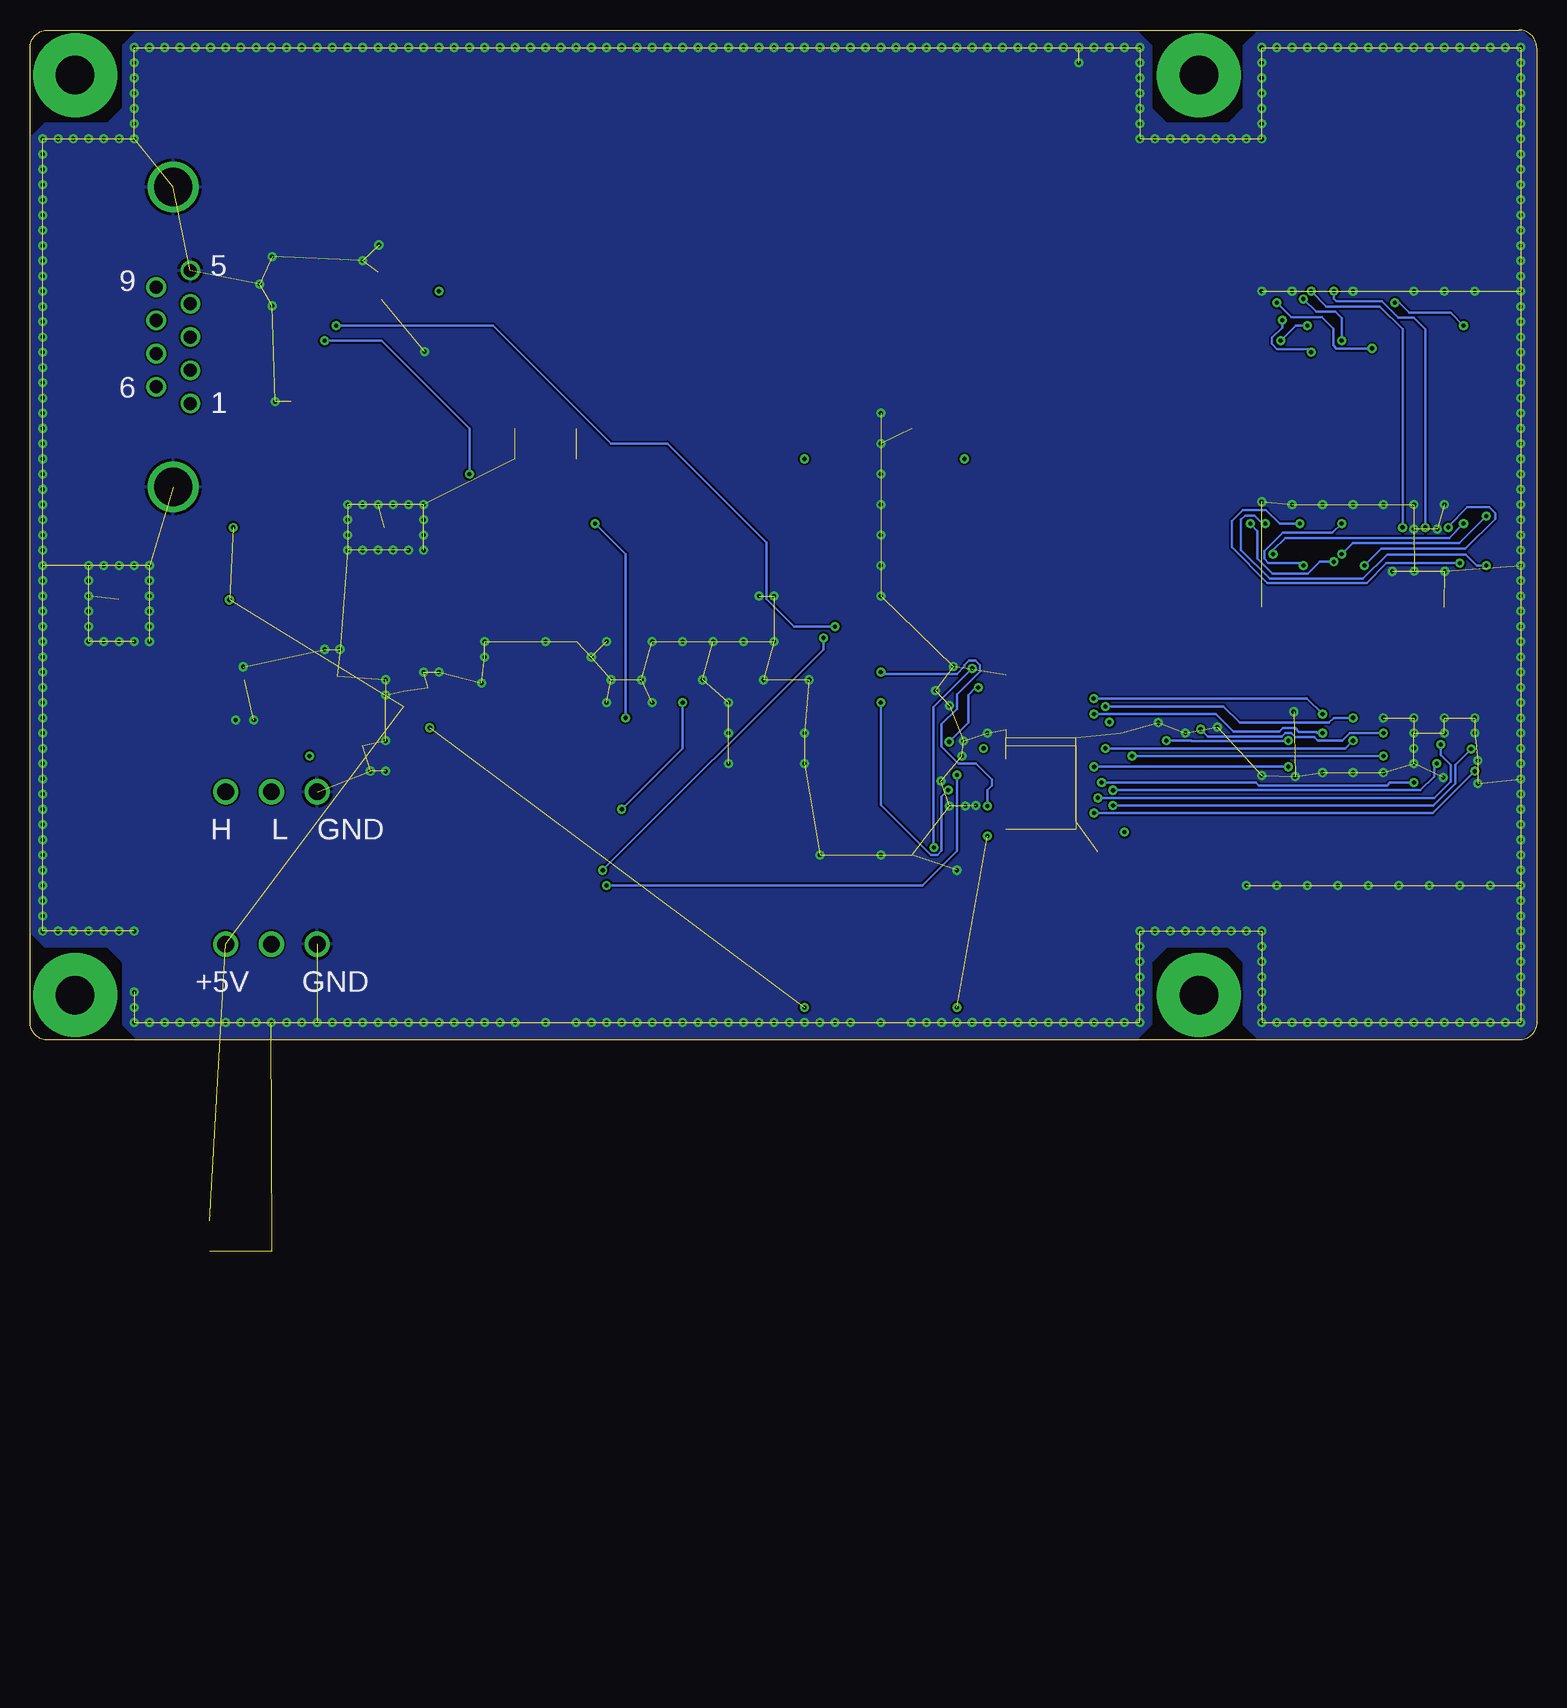
[diagram p6: board, bottom side, seen from below]

Size 125.6 x 84.2 mm. Coordinates in mm from the lower left corner, seen from the top.
Outline: 0,82.7 0,1.5 arc90 1.5,0 124.1,0 arc90 125.6,1.5 125.6,82.7 arc90 124.1,84.2 1.5,84.2 arc90 0,82.7
Copper layers (1+2*15+16): Top 0.035mm / dielectric 0.36mm / Route2 0.035mm / dielectric 0.71mm / Route15 0.035mm / dielectric 0.36mm / Bottom 0.035mm
Design rules "default *": minimum track width 6mil, minimum drill 0.35mm, track to track 6mil, track to pad 6mil, pad to pad 6mil, via to via 6mil, smd to smd 6mil, copper to edge 3mil, drill to drill 6mil, minimum pad ring 10mil, minimum via ring 8mil, stop-mask expansion 4mil, vias tented up to drill 15mil, thermal gap 10mil

### Footprints (pad centres in the part's own frame; a part is rotated, then mirrored left to right if it is on the bottom)
WCAP-AS5H_10X10.5(DXL) = smd 4.4 x 1.9: 1 4.35,0; 2 -4.35,0
WCAP-CSGP_0805_H0.8_R = smd 0.9 x 1.3: 1 -0.95,0; 2 0.95,0
WE-TVSP_DO-214AB_BIDIRECTIONAL = smd 2.3 x 3.3: 1 -3.5,0; 2 3.5,0
WE-TVS_SOT23-3L = smd 0.9 x 1.4: 1 -0.95,-1.05; 2 0.95,-1.05; 3 0,1.05
61231620621 = smd 1.2 x 4.75: 1 -8.89,-2.875; 2 -8.89,2.875; 3 -6.35,-2.875; 4 -6.35,2.875; 5 -3.81,-2.875; 6 -3.81,2.875; 7 -1.27,-2.875; 8 -1.27,2.875; 9 1.27,-2.875; 10 1.27,2.875; 11 3.81,-2.875; 12 3.81,2.875; 13 6.35,-2.875; 14 6.35,2.875; 15 8.89,-2.875; 16 8.89,2.875
691357310006B = drill 1.4: 1 -3.81,-6.35; 2 0,-6.35; 3 3.81,-6.35; 4 -3.81,6.35; 5 0,6.35; 6 3.81,6.35
618009231421 = drill 1.09: 1 -5.54,8.715; 2 -2.77,8.715; 3 0,8.715; 4 2.77,8.715; 5 5.54,8.715; 6 -4.155,5.875; 7 -1.385,5.875; 8 1.385,5.875; 9 4.155,5.875 | drill 3.2: S1 -12.495,7.295; S2 12.495,7.295
61003221821 = smd 1 x 1.8: 1 -19.05,2.6; 2 -19.05,-2.6; 3 -16.51,2.6; 4 -16.51,-2.6; 5 -13.97,2.6; 6 -13.97,-2.6; 7 -11.43,2.6; 8 -11.43,-2.6; 9 -8.89,2.6; 10 -8.89,-2.6; 11 -6.35,2.6; 12 -6.35,-2.6; 13 -3.81,2.6; 14 -3.81,-2.6; 15 -1.27,2.6; 16 -1.27,-2.6; 17 1.27,2.6; 18 1.27,-2.6; 19 3.81,2.6; 20 3.81,-2.6; 21 6.35,2.6; 22 6.35,-2.6; 23 8.89,2.6; 24 8.89,-2.6; 25 11.43,2.6; 26 11.43,-2.6; 27 13.97,2.6; 28 13.97,-2.6; 29 16.51,2.6; 30 16.51,-2.6; 31 19.05,2.6; 32 19.05,-2.6
61003021821 = smd 1 x 1.8: 1 -17.78,2.6; 2 -17.78,-2.6; 3 -15.24,2.6; 4 -15.24,-2.6; 5 -12.7,2.6; 6 -12.7,-2.6; 7 -10.16,2.6; 8 -10.16,-2.6; 9 -7.62,2.6; 10 -7.62,-2.6; 11 -5.08,2.6; 12 -5.08,-2.6; 13 -2.54,2.6; 14 -2.54,-2.6; 15 0,2.6; 16 0,-2.6; 17 2.54,2.6; 18 2.54,-2.6; 19 5.08,2.6; 20 5.08,-2.6; 21 7.62,2.6; 22 7.62,-2.6; 23 10.16,2.6; 24 10.16,-2.6; 25 12.7,2.6; 26 12.7,-2.6; 27 15.24,2.6; 28 15.24,-2.6; 29 17.78,2.6; 30 17.78,-2.6
61004021821 = smd 1 x 1.8: 1 -24.13,2.6; 2 -24.13,-2.6; 3 -21.59,2.6; 4 -21.59,-2.6; 5 -19.05,2.6; 6 -19.05,-2.6; 7 -16.51,2.6; 8 -16.51,-2.6; 9 -13.97,2.6; 10 -13.97,-2.6; 11 -11.43,2.6; 12 -11.43,-2.6; 13 -8.89,2.6; 14 -8.89,-2.6; 15 -6.35,2.6; 16 -6.35,-2.6; 17 -3.81,2.6; 18 -3.81,-2.6; 19 -1.27,2.6; 20 -1.27,-2.6; 21 1.27,2.6; 22 1.27,-2.6; 23 3.81,2.6; 24 3.81,-2.6; 25 6.35,2.6; 26 6.35,-2.6; 27 8.89,2.6; 28 8.89,-2.6; 29 11.43,2.6; 30 11.43,-2.6; 31 13.97,2.6; 32 13.97,-2.6; 33 16.51,2.6; 34 16.51,-2.6; 35 19.05,2.6; 36 19.05,-2.6; 37 21.59,2.6; 38 21.59,-2.6; 39 24.13,2.6; 40 24.13,-2.6
SMT-JUMPER_2_NO_SILK_ROUND = smd 0.152 x 0.305: 1 -1.27,0; 2 1.27,0
R0805 = smd 1.3 x 1.5: 1 -0.95,0; 2 0.95,0
SOIC16 = smd 0.6 x 2.2: 1 -4.445,-2.8; 2 -3.175,-2.8; 3 -1.905,-2.8; 4 -0.635,-2.8; 5 0.635,-2.8; 6 1.905,-2.8; 7 3.175,-2.8; 8 4.445,-2.8; 9 4.445,2.8; 10 3.175,2.8; 11 1.905,2.8; 12 0.635,2.8; 13 -0.635,2.8; 14 -1.905,2.8; 15 -3.175,2.8; 16 -4.445,2.8
SOIC127P602X173-8N-V = smd 1.47 x 0.65: 1 -2.765,1.905; 2 -2.765,0.635; 3 -2.765,-0.635; 4 -2.765,-1.905; 5 2.765,-1.905; 6 2.765,-0.635; 7 2.765,0.635; 8 2.765,1.905
TSSOP20 = smd 0.305 x 0.991: 1 -2.925,-2.918; 2 -2.275,-2.918; 3 -1.625,-2.918; 4 -0.975,-2.918; 5 -0.325,-2.918; 6 0.325,-2.918; 7 0.975,-2.918; 8 1.625,-2.918; 9 2.275,-2.918; 10 2.925,-2.918; 11 2.925,2.918; 12 2.275,2.918; 13 1.625,2.918; 14 0.975,2.918; 15 0.325,2.918; 16 -0.325,2.918; 17 -0.975,2.918; 18 -1.625,2.918; 19 -2.275,2.918; 20 -2.925,2.918

### Placement (x,y rotation side)
C1  100.4,42.73 0 top
C2  36.6,16.65 90 top
C3  95.64,64.01 0 top
C4  93.1,59.88 90 top
C5  35.63,25.59 0 top
C6  95.95,53.15 180 top
C7  99.45,53.21 180 top
C8  102.88,53.21 0 top
C15  107.7,29.08 90 top
C17  92.4,28.45 90 top
C19  98.81,24.57 180 top
D1  114.69,36.7 180 top
D11  107.7,24.32 0 top
HUB08RG  14.04,68.77 0 top
HUB12RG  14.04,50.99 0 top
HUB75RGB  14.04,33.21 0 top
HUB75RGB.  14.04,15.43 0 top
J1  105.48,14.35 0 top
J2  120.95,58.61 90 top
J3  108.02,-34.1 270 top  (outside the outline)
J4  80.08,-32.83 270 top  (outside the outline)
J5  82.62,26.86 270 top
J6  54.68,26.86 270 top
JP1  28.01,23.05 90 top
R1  110.62,26.86 270 top
R3  104.84,26.86 270 top
U2  99.45,58.93 0 top
U4  97.22,28.45 0 top
U8  41.34,27.5 90 top
U9  41.34,20.51 90 top

### Tracks (layer width: path | path; a pad name or v marks a point on that pad's centre or on a via)
0
  Top 0.406: J5.29 J5.30
16
  Top 0.406: J5.26 J5.25
17
  Top 0.406: J5.23 J5.24
34
  Top 0.406: J6.12 J6.11
232_RX
  Top 0.203: J2.2 109.54,58.54 109.47,58.61 105.16,62.92 104.43,63.65 99.41,63.65 98.81,63.05 U2.13
232_TX
  Top 0.203: U2.14 97.54,63.37 98.18,64.01 106.84,64.01 J2.3
+3V3  (via drill 0.35)
  Top 0.203: 94.88,61.86 U2.16
  Top 0.406: C3.1 94.88,63.82 94.88,61.86 | J6.3 J6.4
  Top 1.016: U4.5 99.99,24.8 C19.1 101.42,24.57 v102.31,23.69 | J6.3 v61.03,48.45 | C3.1 93.1,62.42 v91.51,62.42 C4.2 | J6.4 v47.7,48.45
  Route2 1.016: v61.03,48.45 75,62.42 v91.51,62.42 | v61.03,48.45 72.46,37.02 72.46,23.05 74.36,21.15 92.02,21.15 94.56,23.69 v102.31,23.69 | v47.7,48.45 v61.03,48.45
+5V  (via drill 0.35)  (9 unrouted)
  Top 0.203: U9.1 45.22,17.59 v45.79,17.02 | U8.1 45.86,24.57 v46.11,24.32
  Top 0.406: J6.40 J6.39 | v34.36,17.34 34.62,17.6 C2.2 38.41,17.6 U9.20 | U8.20 37.6,24.57 C5.2 35.67,26.5 v35.61,26.5 | J3.2 J3.1
  Top 1.016: C1.1 v108.66,42.73 | D1.2 v108.97,36.7 | U4.3 92.71,27.81 C17.1 92.27,27.37 v92.27,26.03 | J6.40 v48.33,2.73 | J6.39 v61.03,2.73
  pour Route15: 119.12,7.75 124.33,7.75 125.6,9.02 125.6,75.18 124.33,76.45 119.12,76.45 117.85,77.72 117.85,82.93 116.58,84.2 33.42,84.2 32.15,82.93 32.15,77.72 30.88,76.45 25.67,76.45 24.4,77.72 24.4,82.93 23.13,84.2 1.27,84.2 0,82.93 0,1.27 1.27,0 23.13,0 24.4,1.27 24.4,6.48 25.67,7.75 30.88,7.75 32.15,6.48 32.15,1.27 33.42,0 116.58,0 117.85,1.27 117.85,6.48
ADDRA_3V
  Top 0.203: U8.5 45.47,27.17 45.47,27.18 49.21,27.18 49.7,27.67 49.7,28.66 49.48,28.88 49.48,29.41 49.85,29.78 50.37,29.78 50.38,29.77 59.18,29.77 60.08,30.67 J5.18
  Top 0.406: J5.18 J5.17
ADDRB_3V  (via drill 0.35)
  Top 0.203: U9.9 45.74,22.79 45.79,22.73 49.36,22.73 51.17,24.55 61.4,24.55 63.57,26.72 75.81,26.72 v75.95,26.86 | J5.8 78.81,43.37 v78.49,43.05
  Top 0.406: J5.8 J5.7
  Bottom 0.203: v78.49,43.05 75.95,40.51 v75.95,26.86
ADDRC_3V
  Top 0.203: U8.6 45.47,27.82 45.47,27.81 46.95,27.81 50.92,31.78 57.69,31.78 57.86,31.94 73.73,31.94 77.54,35.75 J5.14
  Top 0.406: J5.14 J5.13
ADDRD_3V  (via drill 0.35)
  Top 0.203: U8.4 45.45,26.52 45.47,26.54 49.18,26.54 50.26,27.62 50.26,28.07 51.43,29.23 68.81,29.23 69.92,28.13 v71.19,28.13 | J5.28 77.54,17.97 v76.27,19.24
  Top 0.406: J5.28 J5.27
  Bottom 0.203: v76.27,19.24 71.19,24.32 v71.19,28.13
ADDRE_3V  (via drill 0.35)
  Top 0.203: v48.98,24.87 49.6,24.87 50.32,25.59 J6.22 | v46.55,29.39 46.28,29.12 U8.8
  Top 0.406: J6.21 J6.22
  Bottom 0.203: v48.98,24.87 47.38,26.47 47.38,28.78 46.77,29.39 v46.55,29.39
B0_3V  (via drill 0.35)
  Top 0.203: U9.4 45.77,19.54 v45.79,19.52
  Top 0.406: J6.18 v54.68,30.67 J6.17
  Bottom 0.203: v45.79,19.52 45.79,20.83 45.41,21.2 45.41,21.73 46.74,23.05 48.19,23.05 49.61,24.48 49.61,26.34 48.33,27.61 48.33,28.82 46.43,30.73 46.43,31.25 46.8,31.62 47.32,31.62 47.69,31.25 47.69,31.18 48.35,30.52 54.53,30.52 v54.68,30.67
B1_3V
  Top 0.203: J5.20 78.81,28.13 77.4,26.72 77.4,25.2 76.4,24.19 51.32,24.19 48.59,21.46 46.05,21.46 46.03,21.49 U9.7
  Top 0.406: J5.19 J5.20
CAN1_RXD
  Top 0.203: U4.4 95.95,26.54 96.59,27.18 96.59,33.84 93.56,36.88 68.51,36.88 67.38,35.75 J6.13
  Top 0.406: J6.14 J6.13
CAN1_TXD
  Top 0.203: U4.1 94.37,30.35 93.41,31.3 90.88,31.3 90.24,30.67 90.24,27.5 88.34,25.59 J5.21
  Top 0.406: J5.22 J5.21
CAN_N
  Top 0.254: J1.5 106.75,21.97 D11.1 104.84,25.18 R3.2 103.58,27.18 103.58,28.77 104.21,29.4 105.16,29.4 107.7,31.94 107.7,33.21 106.11,34.8 105.16,34.8 104.3,33.93 104.3,30.88 101.23,27.81 U4.6
CAN_P
  Top 0.254: J1.6 108.65,21.34 D11.2 110.62,25.24 R1.2 111.83,27.12 111.83,28.77 110.88,29.72 110.33,29.72 108.11,31.94 108.11,33.38 106.28,35.2 104.93,35.2 103.89,34.16 103.89,31.74 101.23,29.08 U4.7
CLK
  Top 0.406: J5.40 J5.39
CLK_3V  (via drill 0.35)
  Top 0.203: U9.8 45.47,22.14 45.51,22.1 v48.33,22.1 | v77.54,12.89 J5.32
  Top 0.406: J5.32 J5.31
  Bottom 0.203: v48.33,22.1 48.33,15.75 51.19,12.89 v77.54,12.89
CMD
  Top 0.406: J6.37 J6.38
D0
  Top 0.406: J5.37 J5.38
D1
  Top 0.406: J5.36 J5.35
D2
  Top 0.406: J6.33 J6.34
D3
  Top 0.406: J6.36 J6.35
EN
  Top 0.406: J6.6 J6.5
G0_3V
  Top 0.203: U9.3 53.05,18.89 54.68,20.51
  Top 0.406: J6.26 54.68,20.51 J6.25
G1_3V
  Top 0.203: U9.5 45.78,20.19 45.79,20.19 49.6,20.19 52.08,22.67 J6.24
  Top 0.406: J6.24 J6.23
GND  (via drill 0.35)  (517 unrouted)
  Top 0.203: v7.79,21.88 7.79,18.41 HUB75RGB..4 | HUB75RGB..16 v22.93,22.06 | HUB08RG.1 v5.15,62.42 | HUB08RG.3 v7.69,62.42 | HUB08RG.5 v10.23,62.42 | HUB08RG.15 v22.93,62.42 | HUB08RG.13 v20.39,62.42 | HUB12RG.3 v7.69,44.64 | HUB12RG.15 v22.93,44.87 | HUB12RG.13 v20.39,44.64 | HUB12RG.11 v17.85,44.64 | HUB12RG.9 v15.31,44.64 | HUB12RG.7 v12.77,44.64 | HUB12RG.5 v10.23,44.64
  Top 0.305: U2.15 96.27,63.69 C3.2
  Top 0.406: J5.2 J5.1 | J6.2 J6.1
  Top 0.508: C15.2 107.83,30.16 v107.83,31.11 | v106.94,26.67 106.94,26.13 D11.3 108.47,26.13 v108.47,26.67
  other vias: 105.16,53.21 97.86,64.96 61.03,25.59 61.03,23.05 67.38,23.05 67.38,25.59 67.38,28.13 77.54,28.13 73.73,28.13 63.57,33.21 63.57,37.02 1.34,82.74 2.61,82.74 3.88,82.74 5.15,82.74 6.42,82.74 7.69,82.74 8.96,82.74 10.23,82.74 11.5,82.74 12.77,82.74 14.04,82.74 15.31,82.74 16.58,82.74 17.85,82.74 22.93,82.74 21.66,82.74 20.39,82.74 19.12,82.74 33.09,82.74 34.36,82.74 35.63,82.74 36.9,82.74 38.17,82.74 39.44,82.74 40.71,82.74 41.98,82.74 43.25,82.74 44.52,82.74 45.79,82.74 47.06,82.74 48.33,82.74 49.6,82.74 1.34,81.47 1.34,80.2 1.34,78.93 1.34,77.66 1.34,76.39 1.34,75.12 60.65,30.04 64.46,30.04 69.54,30.04 74.62,30.04 77.16,30.04 47.77,24.93 45.79,25.59 47.92,23.69 5.15,25.59 5.15,26.86 7.69,26.86 7.69,25.59 10.23,25.59 10.23,26.86 12.77,26.86 10.23,24.32 10.23,23.05 12.77,22.29 15.31,22.29 17.85,22.29 20.14,21.96 48.97,27.88 66.11,33.21 68.65,33.21 71.19,33.21 73.73,33.21 77.54,33.21 78.81,31.94 50.11,29.15 48.61,31.15 64.84,37.02 92.78,44.64 92.78,43.37 92.78,42.1 92.78,40.83 94.05,40.83 99.13,40.83 99.13,42.1 99.13,43.37 99.13,44.64 97.86,44.64 96.59,44.64 95.32,44.64 94.05,44.64 95.32,40.83 96.59,40.83 97.86,40.83 115.64,34.48 115.64,35.75 115.64,37.02 115.64,38.29 115.64,39.56 116.91,39.56 118.18,39.56 119.45,39.56 120.72,39.56 120.72,38.29 120.72,37.02 120.72,35.75 120.72,34.48 120.72,33.21 119.45,33.21 118.18,33.21 116.91,33.21 115.64,33.21 50.87,82.74 52.14,82.74 53.41,82.74 54.68,82.74 55.95,82.74 57.22,82.74 58.49,82.74 59.76,82.74 61.03,82.74 62.3,82.74 63.57,82.74 64.84,82.74 66.11,82.74 67.38,82.74 86.43,82.74 87.7,82.74 88.97,82.74 90.24,82.74 91.51,82.74 92.78,82.74 94.05,82.74 95.32,82.74 96.59,82.74 97.86,82.74 99.13,82.74 100.4,82.74 101.67,82.74 102.94,82.74 68.65,82.74 69.92,82.74 71.19,82.74 72.46,82.74 73.73,82.74 75,82.74 76.27,82.74 77.54,82.74 78.81,82.74 80.08,82.74 81.35,82.74 82.62,82.74 83.89,82.74 85.16,82.74 104.21,82.74 105.48,82.74 106.75,82.74 108.02,82.74 109.29,82.74 110.56,82.74 111.83,82.74 113.1,82.74 114.37,82.74 115.64,82.74 116.91,82.74 22.93,81.47 22.93,80.2 22.93,78.93 22.93,77.66 22.93,76.39 33.09,81.47 33.09,80.2 33.09,78.93 33.09,77.66 33.09,76.39 33.09,75.12 31.82,75.12 30.55,75.12 29.28,75.12 28.01,75.12 26.74,75.12 25.47,75.12 24.2,75.12 22.93,75.12 28.01,9.08 29.28,9.08 30.55,9.08 31.82,9.08 33.09,9.08 33.09,7.81 33.09,6.54 33.09,5.27 22.93,6.54 22.93,7.81 22.93,9.08 24.2,9.08 25.47,9.08 26.74,9.08 22.93,5.27 22.93,4 22.93,2.73 22.93,1.46 21.66,1.46 20.39,1.46 33.09,1.46 34.36,1.46 35.63,1.46 33.09,2.73 33.09,4 4.9,21.4 4.9,23.3 6.42,12.89 11.5,12.89 16.58,12.89 19.12,12.89 21.66,12.89 24.2,12.89 3.88,12.89 8.96,12.89 14.04,12.89 19.12,1.46 17.85,1.46 1.34,1.46 1.34,2.73 1.34,4 1.34,5.27 36.9,1.46 38.17,1.46 39.44,1.46 40.71,1.46 41.98,1.46 43.25,1.46 44.52,1.46 45.79,1.46 47.06,1.46 48.33,1.46 49.6,1.46 50.87,1.46 52.14,1.46 54.68,1.46 57.22,1.46 58.49,1.46 59.76,1.46 61.03,1.46 62.3,1.46 63.57,1.46 64.84,1.46 66.11,1.46 67.38,1.46 86.43,1.46 87.7,1.46 88.97,1.46 90.24,1.46 91.51,1.46 92.78,1.46 94.05,1.46 95.32,1.46 96.59,1.46 97.86,1.46 99.13,1.46 100.4,1.46 101.67,1.46 102.94,1.46 68.65,1.46 69.92,1.46 71.19,1.46 72.46,1.46 73.73,1.46 75,1.46 76.27,1.46 77.54,1.46 78.81,1.46 80.08,1.46 82.62,1.46 85.16,1.46 104.21,1.46 105.48,1.46 106.75,1.46 108.02,1.46 109.29,1.46 110.56,1.46 111.83,1.46 113.1,1.46 114.37,1.46 115.64,1.46 16.58,1.46 15.31,1.46 14.04,1.46 12.77,1.46 2.61,1.46 3.88,1.46 1.34,6.54 1.34,7.81 1.34,9.08 1.34,10.35 1.34,11.62 1.34,12.89 1.34,14.16 1.34,15.43 1.34,16.7 1.34,17.97 1.34,19.24 1.34,20.51 1.34,21.78 1.34,23.05 1.34,24.32 1.34,25.59 1.34,44.64 1.34,45.91 1.34,47.18 1.34,48.45 1.34,49.72 1.34,50.99 1.34,52.26 1.34,53.53 1.34,54.8 1.34,56.07 1.34,57.34 1.34,58.61 1.34,59.88 1.34,61.15 1.34,26.86 1.34,28.13 1.34,29.4 1.34,30.67 1.34,31.94 1.34,33.21 1.34,34.48 1.34,35.75 1.34,37.02 1.34,38.29 1.34,39.56 1.34,40.83 1.34,42.1 1.34,43.37 1.34,62.42 1.34,63.69 1.34,64.96 1.34,66.23 1.34,67.5 1.34,68.77 1.34,70.04 1.34,71.31 1.34,72.58 1.34,73.85 11.5,1.46 10.23,1.46 8.96,1.46 7.69,1.46 6.42,1.46 5.15,1.46 118.18,9.08 119.45,9.08 120.72,9.08 121.99,9.08 123.26,9.08 116.91,2.73 116.91,1.46 116.91,4 116.91,9.08 124.53,9.08 124.53,10.35 124.53,11.62 124.53,12.89 124.53,14.16 124.53,15.43 124.53,16.7 124.53,17.97 124.53,19.24 124.53,20.51 124.53,21.78 124.53,23.05 124.53,24.32 124.53,25.59 124.53,26.86 124.53,28.13 124.53,29.4 124.53,30.67 124.53,49.72 124.53,50.99 124.53,52.26 124.53,53.53 124.53,54.8 124.53,56.07 124.53,57.34 124.53,58.61 124.53,59.88 124.53,61.15 124.53,62.42 124.53,63.69 124.53,64.96 124.53,66.23 124.53,31.94 124.53,33.21 124.53,34.48 124.53,35.75 124.53,37.02 124.53,38.29 124.53,39.56 124.53,40.83 124.53,42.1 124.53,43.37 124.53,44.64 124.53,45.91 124.53,47.18 124.53,48.45 124.53,67.5 124.53,68.77 124.53,70.04 124.53,71.31 124.53,72.58 124.53,73.85 124.53,75.12 116.91,81.47 123.26,75.12 121.99,75.12 120.72,75.12 116.91,80.2 116.91,78.93 116.91,77.66 116.91,76.39 116.91,75.12 118.18,75.12 119.45,75.12 99.77,32.58 101.03,32.58 95.95,28.77 95.95,30.04 87.7,31.94 95.95,24.96 97.22,22.42 95.95,22.42 8.3,42.61 10.23,42.61 10.2,39.1 12.03,39.08 7.66,39.08 29.28,25.59 31.54,26.45 26.61,26.1 20.26,27.37 106.45,63.03 105.43,65.32 105.4,61.2 92.7,57.39 96.51,66.28 87.95,29.76 46.76,19.54 47.62,19.52 48.97,19.52 49.65,21.6 54.68,52.26 54.68,49.72 54.68,47.18 54.68,44.64 54.68,42.1 54.68,39.56 54.68,37.02 54.68,15.43 59.76,15.43 48.33,14.16 38.17,81.47 82.62,33.21 87.7,33.21 15.31,62.42 92.78,30.67 91.51,30.67
  pour Bottom: 119.12,7.75 124.33,7.75 125.6,9.02 125.6,75.18 124.33,76.45 119.12,76.45 117.85,77.72 117.85,82.93 116.58,84.2 33.42,84.2 32.15,82.93 32.15,77.72 30.88,76.45 25.67,76.45 24.4,77.72 24.4,82.93 23.13,84.2 1.27,84.2 0,82.93 0,1.27 1.27,0 23.13,0 24.4,1.27 24.4,6.48 25.67,7.75 30.88,7.75 32.15,6.48 32.15,1.27 33.42,0 116.58,0 117.85,1.27 117.85,6.48
  pour Top: 119.12,7.75 124.33,7.75 125.6,9.02 125.6,75.18 124.33,76.45 119.12,76.45 117.85,77.72 117.85,82.93 116.58,84.2 33.42,84.2 32.15,82.93 32.15,77.72 30.88,76.45 25.67,76.45 24.4,77.72 24.4,82.93 23.13,84.2 1.27,84.2 0,82.93 0,1.27 1.27,0 23.13,0 24.4,1.27 24.4,6.48 25.67,7.75 30.88,7.75 32.15,6.48 32.15,1.27 33.42,0 116.58,0 117.85,1.27 117.85,6.48
  pour Route2: 119.12,7.75 124.33,7.75 125.6,9.02 125.6,75.18 124.33,76.45 119.12,76.45 117.85,77.72 117.85,82.93 116.58,84.2 33.42,84.2 32.15,82.93 32.15,77.72 30.88,76.45 25.67,76.45 24.4,77.72 24.4,82.93 23.13,84.2 1.27,84.2 0,82.93 0,1.27 1.27,0 23.13,0 24.4,1.27 24.4,6.48 25.67,7.75 30.88,7.75 32.15,6.48 32.15,1.27 33.42,0 116.58,0 117.85,1.27 117.85,6.48
LAT_3V  (via drill 0.35)
  Top 0.203: U8.7 45.45,28.47 45.47,28.45 46.81,28.45 50.54,32.18 57.54,32.18 57.73,32.37 58.29,32.37 v59.44,33.53 | v77.86,14.16 76.98,14.16 76.27,13.45 76.27,11.11 77.03,10.35 J5.34
  Top 0.406: J5.33 J5.34
  Bottom 0.203: v77.86,14.16 59.44,32.58 v59.44,33.53
M1_A  (via drill 0.35)
  Top 0.203: HUB75RGB..9 16.26,13.51 16.26,26.86 | 16.26,26.86 16.26,29.38 HUB75RGB.9 16.26,31.29 v16.26,40.51 | U8.15 v35.95,27.82 v35.95,27.81 | v15.31,26.86 16.26,26.86 | HUB08RG.2 4.2,70.69 4.2,54.82 HUB12RG.2 4.2,52.91 v4.2,43.69
  Bottom 0.203: v15.31,26.86 16.93,26.86 17.32,26.47 24.76,26.47 26.1,27.81 v35.95,27.81 | v4.2,43.69 6.45,41.43 15.34,41.43 v16.26,40.51
M1_B  (via drill 0.35)
  Top 0.203: HUB75RGB..10 14.36,19.26 14.36,24.96 | 14.36,24.96 14.36,35.13 HUB75RGB.10 14.36,37.04 v14.36,39.56 | U9.11 37.15,23.44 36.27,24.32 v35.95,24.32 | v15.31,24.96 14.36,24.96 | HUB08RG.4 6.74,70.69 6.74,54.82 HUB12RG.4 6.74,52.91 6.74,43.37 v7.37,42.73
  Bottom 0.203: v35.95,24.32 15.95,24.32 v15.31,24.96 | v7.37,42.73 7.37,42.82 5.77,44.42 3.95,44.42 3.46,43.94 3.46,43.44 5.94,40.96 12.96,40.96 v14.36,39.56
M1_B0  (via drill 0.35)
  Top 0.203: HUB75RGB..3 6.79,13.46 6.79,24.64 | HUB75RGB.3 6.79,29.43 6.79,24.64 | U9.16 v36.59,20.19 v36.58,20.19 | v8.01,24.64 6.79,24.64
  Bottom 0.203: v36.58,20.19 8.52,20.19 7.16,21.55 7.16,22.92 8.01,23.77 v8.01,24.64
M1_B1  (via drill 0.35)
  Top 0.203: HUB75RGB..7 11.82,13.51 11.82,23.69 | HUB75RGB.7 11.82,29.38 11.82,23.69 | U9.13 38.39,22.1 36.27,22.1 34.68,23.69 v33.73,23.69 | v12.77,23.69 11.82,23.69
  Bottom 0.203: v33.73,23.69 v12.77,23.69
M1_C  (via drill 0.35)
  Top 0.203: HUB75RGB..11 18.8,13.51 18.8,27.18 | 18.8,27.18 18.8,29.38 HUB75RGB.11 18.8,31.29 18.8,39.56 16.9,41.47 13.54,41.47 11.46,43.55 9.42,43.55 9.28,43.69 9.28,52.91 HUB12RG.6 9.28,54.82 9.28,70.69 HUB08RG.6 | U8.14 v36.92,28.47 | v17.85,27.18 18.8,27.18
  Bottom 0.203: v36.92,28.47 19.15,28.47 v17.85,27.18
M1_CLK  (via drill 0.35)
  Top 0.203: HUB75RGB..13 21.34,13.51 21.34,22.79 | 21.34,22.79 21.34,29.38 HUB75RGB.13 21.34,31.29 21.34,39.56 19.01,41.9 15.51,41.9 13.72,43.69 13.72,52.91 HUB12RG.8 13.72,54.82 v13.72,57.66 | U9.12 v36.9,22.79 | v20.71,22.79 21.34,22.79 | HUB08RG.16 21.98,70.69 21.98,61.78 v21.66,61.47
  Bottom 0.203: v36.9,22.79 v20.71,22.79 | v21.66,61.47 20.45,60.26 17.91,60.26 16.95,59.29 16.95,57.91 16.69,57.66 v13.72,57.66
M1_D  (via drill 0.35)
  Top 0.203: HUB75RGB..12 16.9,19.26 16.9,25.59 | 16.9,25.59 16.9,35.13 HUB75RGB.12 16.9,37.04 16.9,39.88 v16.91,39.87 | U8.16 v36.91,27.17 v36.9,27.18 | v17.85,25.59 16.9,25.59 | HUB08RG.8 13.72,70.69 13.72,60.52 15.31,58.93 22.61,58.93 23.88,57.66 23.88,54.82 HUB12RG.16 23.88,52.91 v23.88,43.05
  Bottom 0.203: v36.9,27.18 26.74,27.18 25.27,25.7 21.47,25.7 21.18,25.99 20.13,25.99 19.82,25.68 18.37,25.68 18.28,25.59 v17.85,25.59 | v16.91,39.87 18.09,39.87 19.06,38.9 22.04,38.9 23.27,40.13 23.27,42.44 v23.88,43.05
M1_E  (via drill 0.35)
  Top 0.203: HUB75RGB..8 13.72,19.26 13.72,25.59 | HUB75RGB.8 13.72,35.13 13.72,25.59 | v12.77,25.59 13.72,25.59 | JP1.2 v28.01,25.91
  Bottom 0.203: v28.01,25.91 27.4,25.3 21.26,25.3 20.97,25.59 20.45,25.59 20.13,25.27 18.55,25.27 18.24,24.96 16.2,24.96 15.57,25.59 v12.77,25.59
M1_E_NC
  Top 0.203: U8.12 38.42,29.78 36.04,29.78 31.85,25.59 30.61,25.59 30.23,25.22 30.23,24.69 30.55,24.38 30.55,23.05 29.28,21.78 JP1.1
M1_G0  (via drill 0.35)
  Top 0.203: HUB75RGB..2 4.2,19.26 4.2,24.26 | 4.2,24.26 4.2,35.13 HUB75RGB.2 4.2,37.04 v4.2,39.56 | U9.17 38.41,19.56 v35.31,19.56 | v5.47,24.26 4.2,24.26 | HUB08RG.10 14.36,70.69 14.36,60.83 15.63,59.56 v19.12,59.56 | v21.34,58.29 21.34,54.82 HUB12RG.14 21.34,52.91 21.34,43.37 21.66,43.05 v22.61,43.05
  Bottom 0.203: v5.47,24.26 6.78,22.95 6.78,21.4 8.62,19.56 v35.31,19.56 | v19.12,59.56 20.07,59.56 v21.34,58.29 | v22.61,43.05 22.87,43.05 23.55,43.73 24.29,43.73 24.64,43.38 24.64,40.85 22.27,38.47 14.49,38.47 12.47,40.48 5.92,40.48 4.99,39.56 v4.2,39.56
M1_G1  (via drill 0.35)
  Top 0.203: HUB75RGB..6 9.28,19.26 9.28,23.05 | 9.28,23.05 9.28,35.13 HUB75RGB.6 9.28,37.04 v9.28,42.73 | U9.15 v35.31,20.83 | v8.33,23.05 9.28,23.05 | HUB08RG.12 16.9,70.69 v16.9,62.42
  Bottom 0.203: v8.33,23.05 8.56,22.82 8.56,21.96 9.69,20.83 v35.31,20.83 | v16.9,62.42 16.9,61.78 16.71,61.59 12.93,61.59 11.55,60.21 10.24,60.21 9.28,59.25 v9.28,42.73
M1_LAT  (via drill 0.35)
  Top 0.203: HUB75RGB..14 19.44,19.26 19.44,24.96 | 19.44,24.96 19.44,35.13 HUB75RGB.14 19.44,37.04 v19.44,39.56 | HUB08RG.14 19.44,70.69 19.44,61.78 v19.45,61.78 | U8.13 36.3,29.12 32.14,24.96 v30.87,24.96 | v20.71,24.96 19.44,24.96 | v16.26,58.29 16.26,54.82 HUB12RG.10 16.26,52.91 v16.26,43.05
  Bottom 0.203: v19.45,61.78 18.37,60.7 16.77,60.7 16.26,60.2 v16.26,58.29 | v16.26,43.05 17.02,42.29 21.18,42.29 22.71,40.76 22.71,40.13 22.36,39.78 19.66,39.78 v19.44,39.56 | v30.87,24.96 28.79,24.96 28.78,24.94 21.15,24.94 21.13,24.96 v20.71,24.96
M1_OE  (via drill 0.35)
  Top 0.203: HUB75RGB..15 21.98,13.51 21.98,27.51 | 21.98,27.51 21.98,29.38 HUB75RGB.15 21.98,31.29 v21.98,40.51 | HUB08RG.7 11.82,64.94 v11.82,61.47 | U8.11 35.95,30.42 33.04,27.51 21.98,27.51 | v6.1,59.56 6.1,49.07 HUB12RG.1 6.1,47.16 v6.1,43.05
  Bottom 0.203: v11.82,61.47 11.44,61.47 10.61,60.64 7.18,60.64 v6.1,59.56 | v6.1,43.05 7.29,41.86 20.95,41.86 21.98,40.83 v21.98,40.51
M1_R0  (via drill 0.35)
  Top 0.203: HUB75RGB..1 6.1,13.51 6.1,22.42 | 6.1,22.42 6.1,29.38 HUB75RGB.1 6.1,31.29 6.1,39.43 v6.42,39.75 | U9.18 38.39,18.92 v36.9,18.92 | v5.15,22.42 6.1,22.42 | HUB08RG.9 16.26,64.94 16.26,60.83 16.8,60.3 19.75,60.3 20.04,60.01 v21.22,60.01 | v18.8,57.34 18.8,54.82 HUB12RG.12 18.8,52.91 18.8,43.37 19.12,43.05 v19.76,43.05
  Bottom 0.203: v36.9,18.92 8.64,18.92 v5.15,22.42 | v21.22,60.01 21.22,59.41 22.08,58.54 22.08,58.04 21.65,57.61 19.07,57.61 v18.8,57.34 | v19.76,43.05 21.42,43.05 22.56,44.19 24.49,44.19 25.4,43.28 25.4,41.08 22.44,38.12 14.16,38.12 12.52,39.75 v6.42,39.75
M1_R1  (via drill 0.35)
  Top 0.203: HUB75RGB..5 11.18,13.51 11.18,21.46 | 11.18,21.46 11.18,29.38 HUB75RGB.5 11.18,31.29 v11.18,42.73 | U9.14 38.41,21.46 v36.27,21.46 | v10.23,21.46 11.18,21.46 | HUB08RG.11 18.8,64.94 v18.8,62.42
  Bottom 0.203: v36.27,21.46 23.42,21.46 23.18,21.22 12.47,21.22 12.23,21.46 v10.23,21.46 | v18.8,62.42 17.53,61.15 13.09,61.15 11.18,59.25 v11.18,42.73
MOUNT1  (via drill 3.2 pad 7)
  other vias: 121.85,80.45
MOUNT2  (via drill 3.2 pad 7)
  other vias: 121.85,3.75
MOUNT3  (via drill 3.2 pad 7)
  other vias: 28.15,80.45
MOUNT4  (via drill 3.2 pad 7)
  other vias: 28.15,3.75
N$20
  Top 0.254: R3.1 105.17,28.13 C15.1 110.3,28.13 R1.1
N$33
  Top 0.406: C6.2 U2.1
N$34
  Top 0.406: U2.3 97.54,53.79 C6.1
N$35
  Top 0.406: U2.4 98.81,53.53 C7.2
N$36
  Top 0.406: U2.5 100.08,53.53 C7.1
N$37
  Top 0.254: U2.2 96.27,57.85 95.48,58.64 95.19,58.93 C4.1
N$38
  Top 0.406: U2.6 101.35,53.79 C8.1
OE_3V  (via drill 0.35)
  Top 0.203: v47.06,30.99 45.84,29.77 U8.9 | v50.23,16.07 50.23,13.53 50.87,12.89 J6.32
  Top 0.406: J6.32 J6.31
  Bottom 0.203: v50.23,16.07 50.29,16.12 50.29,27.76 v47.06,30.99
R0_3V
  Top 0.203: U9.2 51.81,18.24 J6.28
  Top 0.406: J6.28 J6.27
R1_3V  (via drill 0.35)
  Top 0.203: v49.05,20.85 49.04,20.84 U9.6
  Top 0.406: J6.20 v54.68,28.13 J6.19
  Bottom 0.203: v49.05,20.85 49.6,20.3 49.6,15.8 49.97,15.43 50.5,15.43 54.68,19.62 v54.68,28.13
RX  (via drill 0.35)
  Top 0.203: v100.08,59.56 U2.12 | v58.49,34.48 58.49,34.42 J6.15
  Top 0.406: J6.16 J6.15
  Bottom 0.203: v100.08,59.56 87,59.56 77.17,49.73 72.47,49.73 64.2,41.46 64.2,36.76 63.57,36.13 61.92,34.48 v58.49,34.48
TX  (via drill 0.35)
  Top 0.203: v101.03,58.29 101.03,61.41 U2.11 | v88.97,47.18 87.7,45.91 J5.5
  Top 0.406: J5.6 J5.5
  Bottom 0.203: v101.03,58.29 96.27,58.29 88.97,50.99 v88.97,47.18
USB_RX
  Top 0.406: J5.12 J5.11
USB_TX
  Top 0.406: J5.9 J5.10
VN
  Top 0.406: J6.9 J6.10
VP
  Top 0.406: J6.8 J6.7
(copper drawn outside any net)
  shapes: Top area x1

### Text on the board
tPlace: HUB08 / RG | WIFI Antenna here. | Top Pin not plugged | HUB12 / RG | HUB75 / RGB | GND, L, H | HUB75 / RGB | 5V | GND
bPlace: 5 | 9 | 6 | 1 | GND | L | H | GND | +5V
tNames: A | B | C | D | G0 | G1 | LT | CK | OE | R0 | R1 | A | B | C | LT | R1 | G1 | D | GND | GND | 3V3 | GND | EN | RS232 TXD | 23 | OE | VP | B | 22 | 34 | TX | G0 | G1 | B | D | LT | 34 | RX | 35 | CAN1 RXD | C | 21 | 32 | RS232 RXD | GND | 33 | B0 | A | 19 | 25 | R1 | B1 | 18 | R0 | B0 | R1 | B1 | A | C | CK | OE | 26 | E | CAN1 TXD | 5 | 27 | G1 | 17 | G0 | G1 | B | D | LT | 14 | G0 | 16 | 12 | R0 | D | 4 | GND | 0 | 13 | OE | CLK | 2 | D2 | LAT | 15 | R0 | B0 | R1 | B1 | A | C | CK | OE | OE | D3 | D1 | CMD | D0 | 5V | CLK | 5V | GND
214bmp: D:/SmartProjects/Snc/a4_bn_logo2.bmp